# EasyEDA Pro project ProProject_基于CW32单片机的墙体探测仪_2024-01-01.epro

# Schematic 基于CW32单片机的墙体探测仪
Create Date: 2023-11-19; Page Name: 基于CW32单片机的墙体探测仪; Project Name: 基于CW32单片机的墙体探测仪; Schematic Name: 基于CW32单片机的墙体探测仪; Update Date: 2023-12-26; Company: 嘉立创EDA; Page Size: A2; Version: V1.0
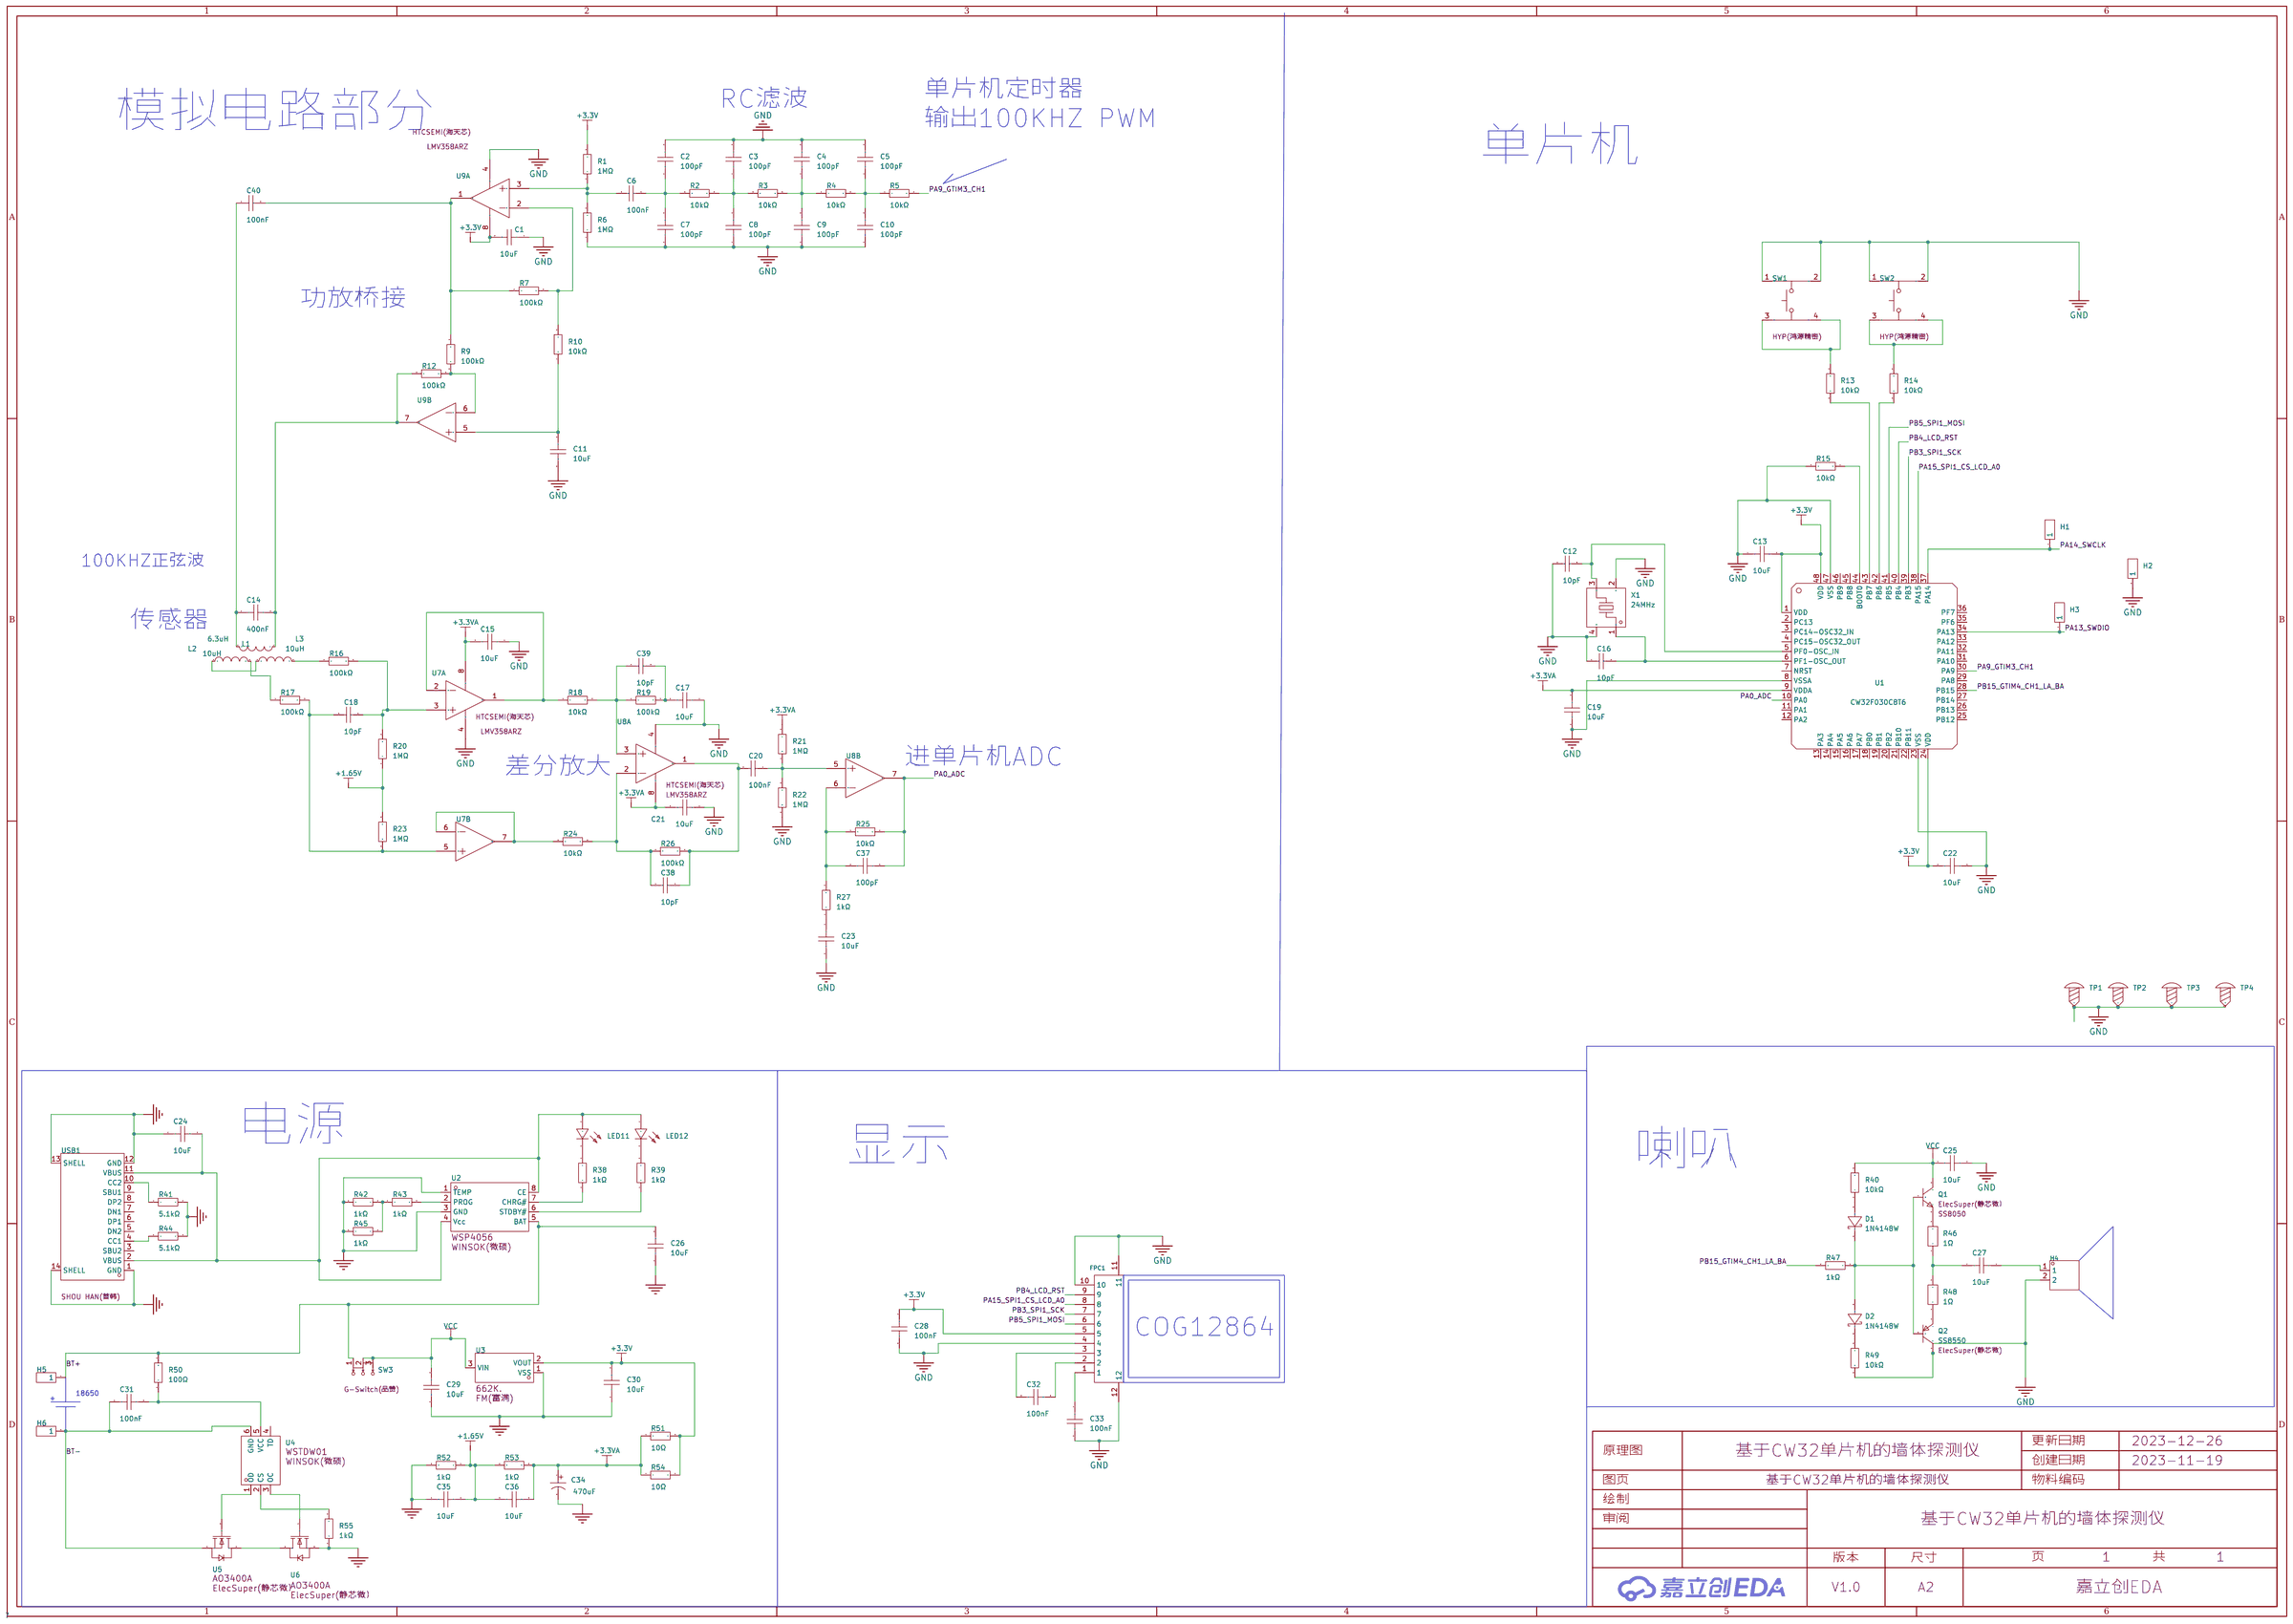
[diagram p0: schematic sheet]

## Parts
C1  10uF  [C0603]
C2  100pF  [C0603]
C3  100pF  [C0603]
C4  100pF  [C0603]
C5  100pF  [C0603]
C6  100nF  [C0603]
C7  100pF  [C0603]
C8  100pF  [C0603]
C9  100pF  [C0603]
C10  100pF  [C0603]
C11  10uF  [C0603]
C12  10pF  [C0603]
C13  10uF  [C0603]
C14  400nF  [CAP-TH_L10.5-W6.0-P7.50-D1.2]
C15  10uF  [C0603]
C16  10pF  [C0603]
C17  10uF  [C0603]
C18  10pF  [C0603]
C19  10uF  [C0603]
C20  100nF  [C0603]
C21  10uF  [C0603]
C22  10uF  [C0603]
C23  10uF  [C0603]
C24  10uF  [C0603]
C25  10uF  [C0603]
C26  10uF  [C0603]
C27  10uF  [C0603]
C28  100nF  [C0603]
C29  10uF  [C0603]
C30  10uF  [C0603]
C31  100nF  [C0603]
C32  100nF  [C0603]
C33  100nF  [C0603]
C34  470uF  [CAP-TH_BD8.0-P3.50-D0.6-FD]
C35  10uF  [C0603]
C36  10uF  [C0603]
C37  100pF  [C0603]
C38  10pF  [C0603]
C39  10pF  [C0603]
C40  100nF  [C0603]
D1  1N4148W  [SOD-123_L2.7-W1.6-LS3.7-FD]
D2  1N4148W  [SOD-123_L2.7-W1.6-LS3.7-FD]
FPC1  -  [FPC-SMD_10P-P1.0_FGS-XJ-H2.0]
H1  -  [HDR-TH_1P-V-M_XKB_X4611WV-01I-C28D40]
H2  -  [HDR-TH_1P-V-M_XKB_X4611WV-01I-C28D40]
H3  -  [HDR-TH_1P-V-M_XKB_X4611WV-01I-C28D40]
H4  -  [HDR-TH_2P-P2.54-V-M-1]
H5  -  [HDR-TH_1P-V-M_XKB_X4611WV-01I-C28D40]
H6  -  [HDR-TH_1P-V-M_XKB_X4611WV-01I-C28D40]
L1  6.3uH  [L1206]
L2  10uH  [L1206]
L3  10uH  [L1206]
LED11  204-10SURD/S530-A3-L  [LED-TH_BD3.0-P2.54-FD]
LED12  204-10SURD/S530-A3-L  [LED-TH_BD3.0-P2.54-FD]
Q1  -  [SOT-23-3_L2.9-W1.3-P1.90-LS2.4-BR]
Q2  SS8550  [SOT-23-3_L2.9-W1.3-P1.90-LS2.4-BR]
R1  1MΩ  [R0603]
R2  10kΩ  [R0603]
R3  10kΩ  [R0603]
R4  10kΩ  [R0603]
R5  10kΩ  [R0603]
R6  1MΩ  [R0603]
R7  100kΩ  [R0603]
R9  100kΩ  [R0603]
R10  10kΩ  [R0603]
R12  100kΩ  [R0603]
R13  10kΩ  [R0603]
R14  10kΩ  [R0603]
R15  10kΩ  [R0603]
R16  100kΩ  [R0603]
R17  100kΩ  [R0603]
R18  10kΩ  [R0603]
R19  100kΩ  [R0603]
R20  1MΩ  [R0603]
R21  1MΩ  [R0603]
R22  1MΩ  [R0603]
R23  1MΩ  [R0603]
R24  10kΩ  [R0603]
R25  10kΩ  [R0603]
R26  100kΩ  [R0603]
R27  1kΩ  [R0603]
R38  1kΩ  [R0603]
R39  1kΩ  [R0603]
R40  10kΩ  [R0603]
R41  5.1kΩ  [R0603]
R42  1kΩ  [R0603]
R43  1kΩ  [R0603]
R44  5.1kΩ  [R0603]
R45  1kΩ  [R0603]
R46  1Ω  [R0603]
R47  1kΩ  [R0603]
R48  1Ω  [R0603]
R49  10kΩ  [R0603]
R50  100Ω  [R0603]
R51  10Ω  [R0603]
R52  1kΩ  [R0603]
R53  1kΩ  [R0603]
R54  10Ω  [R0603]
R55  1kΩ  [R0603]
SW1  -  [SW-TH_4P-L6.0-W6.0-P3.90-LS6.5]
SW2  -  [SW-TH_4P-L6.0-W6.0-P3.90-LS6.5]
SW3  SS-12F20-G070  [SW-TH_G-SWITCH_SS-12F20-G070]
TP1  -  [M3螺丝]
TP2  -  [M3螺丝]
TP3  -  [M3螺丝]
TP4  -  [M3螺丝]
U1  CW32F030C8T6  [LQFP-48_L7.0-W7.0-P0.50-LS9.0-TL]
U2  WSP4056  [SOP-8_L5.1-W3.9-P1.27-LS6.0-BL]
U3  662K.  [SOT-23-3_L2.9-W1.3-P1.90-LS2.4-BR]
U4  WSTDW01  [SOT-23-6_L2.9-W1.6-P0.95-LS2.8-BR]
U5  AO3400A  [SOT-23-3_L3.0-W1.6-P1.90-LS2.8-BR]
U6  AO3400A  [SOT-23-3_L3.0-W1.6-P1.90-LS2.8-BR]
U7  -  [SOP-8_L4.9-W3.9-P1.27-LS6.0-BL]  (sections 1,2)
U8  -  [SOP-8_L4.9-W3.9-P1.27-LS6.0-BL]  (sections 1,2)
U9  -  [SOP-8_L4.9-W3.9-P1.27-LS6.0-BL]  (sections 1,2)
USB1  TYPE-C16PIN2MD(073)  [USB-C-SMD_TYPE-C-6PIN-2MD-073]
X1  24MHz  [CRYSTAL-SMD_4P-L3.2-W2.5-BL]

## Library data of the parts
C1 C11 C13 C15 C17 C19 C21-C27 C29 C30 C35 C36 = CL10A106KP8NNNC: 容值:10uF;精度:±10%;额定电压:10V;材质(温度系数):X5R;; LCSC Part Name: 10uF±10%10V; Supplier Part: C19702; Manufacturer: SAMSUNG(三星); Supplier Footprint: 0603; JLCPCB Part Class: BasicPart; Datasheet: https://atta.szlcsc.com/upload/public/pdf/source/20160103/1457707703378.pdf; Supplier: LCSC; Tolerance: ±10%; Voltage Rated: 10V; Temperature Coefficient: X5R
C2-C5 C7-C10 C37 = CC0603JRNPO9BN101: 容值:100pF;精度:±5%;额定电压:50V;材质(温度系数):NP0;; LCSC Part Name: 100pF ±5% 50V; Supplier Part: C14665; Manufacturer: YAGEO(国巨); Supplier Footprint: 0603; JLCPCB Part Class: Extended Part; Datasheet: https://atta.szlcsc.com/upload/public/pdf/source/20181008/C309499_21CC21451B82C39E3D92150FD6B30293.pdf; Supplier: LCSC; Tolerance: ±5%; Voltage Rated: 50V; Temperature Coefficient: NP0
C6 C20 C40 = 0603B104K500NT: 容值:100nF;精度:±10%;额定电压:50V;材质(温度系数):X7R;; LCSC Part Name: 100nF ±10% 50V; Supplier Part: C30926; Manufacturer: FH(风华); Supplier Footprint: 0603; JLCPCB Part Class: Extended Part; Datasheet: https://atta.szlcsc.com/upload/public/pdf/source/20200305/C486355_26A10D38EF8C2A5C37091D0039909270.pdf; Supplier: LCSC; Tolerance: ±10%; Voltage Rated: 50V; Temperature Coefficient: X7R
C12 C16 C18 C38 C39 = CC0603JRNPO9BN100: 容值:10pF;精度:±5%;额定电压:50V;材质(温度系数):NP0;; LCSC Part Name: 10pF±5%50V; Supplier Part: C106245; Manufacturer: YAGEO(国巨); Supplier Footprint: 0603; JLCPCB Part Class: ExtendedPart; Datasheet: https://atta.szlcsc.com/upload/public/pdf/source/20170505/1493957837406.pdf; Supplier: LCSC; Tolerance: ±5%; Voltage Rated: 50V; Temperature Coefficient: NP0
C14 = MPP404J2A0701: 容值:400nF;精度:±5%;额定电压:100V;; LCSC Part Name: 400nF ±5% 100V; Supplier Part: C484926; Manufacturer: KYET(科雅); Supplier Footprint: 插件,P=7.5mm; JLCPCB Part Class: Extended Part; Datasheet: https://atta.szlcsc.com/upload/public/pdf/source/20200115/C484926_47D01147E547E2FB931F965C1ADAEE71.pdf; Supplier: LCSC; Tolerance: ±5%; Voltage Rated: 100V; Operating Temperature: -40℃~+105℃
C28 C31-C33 = CC0603KRX7R9BB104: 容值:100nF;精度:±10%;额定电压:50V;材质(温度系数):X7R;; LCSC Part Name: 100nF±10%50V; Supplier Part: C14663; Manufacturer: YAGEO(国巨); Supplier Footprint: 0603; JLCPCB Part Class: BasicPart; Datasheet: https://atta.szlcsc.com/upload/public/pdf/source/20180910/C282072_33301C7F631E79921B82A8DAC6BCC5B3.pdf; Supplier: LCSC; Tolerance: ±10%; Voltage Rated: 50V; Temperature Coefficient: X7R
C34 = KM477M016F12RR0VH2FP0: 容值:470uF;精度:±20%;额定电压:16V;; LCSC Part Name: 470uF±20%16V; Supplier Part: C28067; Manufacturer: CX(承兴); Supplier Footprint: 插件,D8xL12mm; JLCPCB Part Class: ExtendedPart; Datasheet: https://atta.szlcsc.com/upload/public/pdf/source/20211027/06D6BA3719C264B639DC286D935D03EA.pdf; Supplier: LCSC; Tolerance: ±20%; Rated Voltage: 16V; φD: 8mm; L: 12mm; Lead Spacing: 3.5mm; Lifetime @ Temp: 2000hrs@105℃
D1 D2 = 1N4148W_C7420318: 二极管配置:独立式;正向压降(Vf):1.25V@150mA;直流反向耐压(Vr):100V;平均整流电流(Io):150mA;功率:400mW;反向恢复时间(trr):4ns;; LCSC Part Name: 电压:100V 电流:150mA; Supplier Part: C7420318; Manufacturer: 宏迦橙; Supplier Footprint: SOD-123; JLCPCB Part Class: Extended Part; Datasheet: https://atta.szlcsc.com/upload/public/pdf/source/20230828/E5C3F7A4272052930A7E03B75759BF50.pdf; Supplier: LCSC; Diode Configuration: 独立式; Forward Voltage (Vf@If): 1.25V@150mA; Reverse Voltage (Vr): 100V; Average Rectified Current (Io): 150mA; Power Dissipation: 400mW; Reverse Leakage Current: 1uA@75V; Reverse Recovery Time (trr): 4ns; Operating Temperature: -55℃~+150℃
FPC1 = AFA01-S10FCA-00: 间距:1mm;触点数量:10;锁定特性:翻盖式;安装类型:卧贴;触点类型:下接;; LCSC Part Name: FPC1.0MM10P翻盖式H2.0mm下接; Supplier Part: C262756; Manufacturer: JS(钜硕电子); Supplier Footprint: P=1mm; JLCPCB Part Class: ExtendedPart; Supplier: LCSC; Pitch: 1mm; Number of Contacts: 10; Locking Feature: 翻盖式; Mounting Type: 卧贴; Contact Type: 下接; Height Above Board: 2mm; FFC, FCB Thickness: 0.3mm~0.3mm
H1-H3 H5 H6 = HDR-M_2.54_1x1P: Supplier Part: C81276; Supplier Footprint: 插件; JLCPCB Part Class: ExtendedPart
H4 = HDR-M_2.54_1x2P: Supplier Part: C124375; Supplier Footprint: 插件
L1-L3 = L_1206
LED11 LED12 = 204-10SURD/S530-A3-L: 发光颜色:红灯;二极管配置:-;主波长:624nm;色温:-;功率:60mW;安装方式:-;; LCSC Part Name: 红灯; Supplier Part: C99771; Manufacturer: EVERLIGHT(亿光); Supplier Footprint: 插件,D=3mm; JLCPCB Part Class: ExtendedPart; Datasheet: https://atta.szlcsc.com/upload/public/pdf/source/20170504/1493866972127.pdf; Supplier: LCSC; Emitted Color: 红灯; Lens Color: 雾状红; Dominant Wavelength: 624nm; Peak Wavelength: 632nm; Forward Current: 20mA; Power Dissipation: 60mW; Viewing Angle: 40°; Operating Temperature: -40℃~+85℃; Lamp Holder Type: 3mm圆形灯头
Q1 = SS8050_C5249676: PolarityNPN耗散功率(W)0.3最大集电极电流(mA)1500集电极-基极电压（V）40饱和压降（V）0.5集电极/基极电流（mA）800/80最大工作频率(MHz)100; LCSC Part Name: SS8050; Supplier Part: C5249676; Manufacturer: ElecSuper(静芯微）; Manufacturer Part: SS8050; Supplier Footprint: SOT-23; JLCPCB Part Class: ExtendedPart; Datasheet: https://atta.szlcsc.com/upload/public/pdf/source/20221109/25143ABAE3EF3AA2633DA047E92DED74.pdf; Supplier: LCSC
Q2 = SS8550_C5249677: 晶体管类型:PNP;集电极电流(Ic):1.5A;集射极击穿电压(Vceo):25V;功率(Pd):300mW;直流电流增益(hFE@Ic,Vce):120;; LCSC Part Name: 耐压:25V 电流:1.5A PNP; Supplier Part: C5249677; Manufacturer: ElecSuper(静芯微); Supplier Footprint: SOT-23; JLCPCB Part Class: Extended Part; Datasheet: https://atta.szlcsc.com/upload/public/pdf/source/20221109/B5F89F270175419A606360AB14C12800.pdf; Supplier: LCSC; Transistor Type: PNP; Collector Current (Ic): 1.5A; Collector-Emitter Breakdown Voltage (Vceo): 25V; Power Dissipation (Pd): 300mW; DC Current Gain (hFE@Ic,Vce): 120; Transition Frequency (fT): 100MHz; Collector Cut-Off Current (Icbo): 100nA; Collector-Emitter Saturation Voltage (VCE(sat)@Ic,Ib): 500mV; Operating Temperature: 150℃
R1 R6 R20-R23 = 0603WAF1004T5E: 电阻类型:厚膜电阻;阻值:1MΩ;精度:±1%;功率:100mW;; LCSC Part Name: 1MΩ±1%100mW; Supplier Part: C22935; Manufacturer: UNI-ROYAL(厚声); Supplier Footprint: 0603; JLCPCB Part Class: BasicPart; Datasheet: https://atta.szlcsc.com/upload/public/pdf/source/20200306/C422600_1E6D84923E4A46A82E41ADD87F860B5C.pdf; Supplier: LCSC; Type: 厚膜电阻; Tolerance: ±1%; Power(Watts): 100mW; Temperature Coefficient: ±100ppm/℃; Overload Voltage (Max): 75V; Operating Temperature Range: -55℃~+155℃
R2-R5 R10 R13-R15 R18 R24 R25 R40 R41 R44 R49 = RC0603FR-0710KL: 电阻类型:厚膜电阻;阻值:10kΩ;精度:±1%;功率:100mW;; LCSC Part Name: 10kΩ±1%100mW; Supplier Part: C98220; Manufacturer: YAGEO(国巨); Supplier Footprint: 0603; JLCPCB Part Class: ExtendedPart; Datasheet: https://atta.szlcsc.com/upload/public/pdf/source/20170522/1495423494387.pdf; Supplier: LCSC; Type: 厚膜电阻; Tolerance: ±1%; Power(Watts): 100mW; Temperature Coefficient: ±100ppm/℃; Overload Voltage (Max): 75V; Operating Temperature Range: -55℃~+155℃
R7 R9 R12 R16 R17 R19 R26 = RC0603FR-07100KL: 电阻类型:厚膜电阻;阻值:100kΩ;精度:±1%;功率:100mW;; LCSC Part Name: 100kΩ±1%100mW; Supplier Part: C14675; Manufacturer: YAGEO(国巨); Supplier Footprint: 0603; JLCPCB Part Class: ExtendedPart; Datasheet: https://atta.szlcsc.com/upload/public/pdf/source/20140324/1457707028752.pdf; Supplier: LCSC; Type: 厚膜电阻; Tolerance: ±1%; Power(Watts): 100mW; Temperature Coefficient: ±100ppm/℃; Overload Voltage (Max): 75V; Operating Temperature Range: -55℃~+155℃
R27 R38 R39 R42 R43 R45 R47 R52 R53 R55 = RC0603FR-071KL: 电阻类型:厚膜电阻;阻值:1kΩ;精度:±1%;功率:100mW;; LCSC Part Name: 1kΩ±1%100mW; Supplier Part: C22548; Manufacturer: YAGEO(国巨); Supplier Footprint: 0603; JLCPCB Part Class: ExtendedPart; Datasheet: https://atta.szlcsc.com/upload/public/pdf/source/20180312/7BD3618A8B6324EA6280B0497A051AB7.pdf; Supplier: LCSC; Type: 厚膜电阻; Tolerance: ±1%; Power(Watts): 100mW; Temperature Coefficient: ±100ppm/℃; Overload Voltage (Max): 75V; Operating Temperature Range: -55℃~+155℃
R46 R48 = SCR0603F1R: 阻值:1Ω;精度:±1%;; LCSC Part Name: 1Ω ±1%; Supplier Part: C3016186; Manufacturer: VO(翔胜); Supplier Footprint: 0603; JLCPCB Part Class: Extended Part; Datasheet: https://atta.szlcsc.com/upload/public/pdf/source/20220513/247AF9639BA21CF93567DC289CCC6A22.pdf; Supplier: LCSC; Tolerance: ±1%
R50 = RC0603FR-07100RL: 电阻类型:厚膜电阻;阻值:100Ω;精度:±1%;功率:100mW;; LCSC Part Name: 100Ω±1%100mW; Supplier Part: C105588; Manufacturer: YAGEO(国巨); Supplier Footprint: 0603; JLCPCB Part Class: ExtendedPart; Datasheet: https://atta.szlcsc.com/upload/public/pdf/source/20170428/1493376742308.pdf; Supplier: LCSC; Type: 厚膜电阻; Tolerance: ±1%; Power(Watts): 100mW; Temperature Coefficient: ±100ppm/℃; Overload Voltage (Max): 75V; Operating Temperature Range: -55℃~+155℃
R51 R54 = 0603WAF100JT5E: 电阻类型:厚膜电阻;阻值:10Ω;精度:±1%;功率:100mW;; LCSC Part Name: 10Ω±1%100mW; Supplier Part: C22859; Manufacturer: UNI-ROYAL(厚声); Supplier Footprint: 0603; JLCPCB Part Class: BasicPart; Datasheet: https://atta.szlcsc.com/upload/public/pdf/source/20200306/C422600_1E6D84923E4A46A82E41ADD87F860B5C.pdf; Supplier: LCSC; Type: 厚膜电阻; Tolerance: ±1%; Power(Watts): 100mW; Temperature Coefficient: ±400ppm/℃; Overload Voltage (Max): 75V; Operating Temperature Range: -55℃~+155℃
SW1 SW2 = 1TS005A-2500-5001: 触点电流:50mA;额定电压(DC):12V;额定功率:0.6W;绝缘电阻:100MΩ;电路结构:单刀单掷;安装方式:直插;带灯:无;作用力:250gf@±50gf;机械寿命:7万次;带支架:否;; LCSC Part Name: 6*6*5mm直插轻触开关; Supplier Part: C255811; Manufacturer: HYP(鸿源精密); Supplier Footprint: 插件,6x6mm; JLCPCB Part Class: ExtendedPart; Datasheet: https://atta.szlcsc.com/upload/public/pdf/source/20180720/C255811_DA12C4E3C20854D48E888AEA64926F5F.pdf; Supplier: LCSC; Contact Current: 50mA; Voltage Rating (DC): 12V; Power Rating: 0.6W; Insulation Resistance: 100MΩ; Circuit: 单刀单掷; Mounting Style: 直插; Actuator Style: 圆形按钮; Actuator/Cap Color: 黑色; With Lamp: 无; Operating Force: 250gf@±50gf; Mechanical Life: 7万次; Operating Temperature: -40℃~+90℃; Pin Style: PC引脚; Switch Length: 6mm; Switch Width: 6mm; Switch Height: 5mm; Strike Gundam: 否
SW3 = SS-12F20-G070: 额定电流(DC):500mA;额定电压(DC):250V;电路结构:单刀双掷;安装方式:直插;机械寿命:-;开关颜色:黑色;; LCSC Part Name: 柄长7mm直插两档滑动开关; Supplier Part: C2848914; Manufacturer: G-Switch(品赞); Supplier Footprint: 插件; JLCPCB Part Class: ExtendedPart; Datasheet: https://atta.szlcsc.com/upload/public/pdf/source/20210825/E0137178672C137814869A76188F885C.pdf; Supplier: LCSC; Current Rating (DC): 500mA; Voltage Rating (DC): 250V; Circuit: 单刀双掷; Mounting Style: 直插; Actuator Color: 黑色; Actuator Style: 矩形柱状; Pin Style: PC引脚; Switch Length: 11.5mm; Switch Width: 5.8mm; Switch Height: 12mm
TP1-TP4 = M3螺丝: Supplier Footprint: 插件
U1 = CW32F030C8T6_C3019113: CPU内核:ARMCortex-M0+;CPU最大主频:64MHz;工作电压范围:1.65V~5.5V;内部振荡器:有;外部时钟频率范围:4MHz~32MHz;程序FLASH容量:-;RAM总容量:8KB;EEPROM/数据FLASH容量:-;GPIO端口数量:39;ADC(单元数/通道数/位数):1@x16ch/12bit;DAC(单元数/通道数/位数):-;(E)PWM(单元数/通道数/位数):-;8位Timer数量:-;16位Timer数量:8;32位Timer数量:-;内部比较器数量:2;U; LCSC Part Name: ARMCortex-M0+64MHzRAM：8KB; Supplier Part: C3019113; Manufacturer: CW(芯源); Supplier Footprint: LQFP-48; JLCPCB Part Class: ExtendedPart; Datasheet: https://atta.szlcsc.com/upload/public/pdf/source/20220516/D60F5E1023A73FFF550D4A77416DDFBC.pdf; Supplier: LCSC; CPU Core: ARMCortex-M0+; Maximum Frequency: 64MHz; Supply Voltage Range: 1.65V~5.5V; Internal Oscillator: 有; External Clock Frequency Rang: 4MHz~32MHz; RAM Size: 8KB; GPIO Ports Number: 39; ADC (Units/Channels/bits): 1@x16ch/12bit; 16Bit Timer Number: 8; CMP Number: 2; U(S)ART Number: 3; I2C Number: 2; (Q)SPI Number: 2; Peripherals / Functions / Protocol Stacks: 片载温度传感器；DMA；看门狗；低电压检测；CRC校验; Operating Temperature Range: -40℃~105℃
U2 = WSP4056: Supplier Part: C2985892; Manufacturer: WINSOK(微硕); Supplier Footprint: SOP-8; JLCPCB Part Class: ExtendedPart; Supplier: LCSC
U3 = 662K.: 输出类型:-;; LCSC Part Name: 662K; Supplier Part: C841298; Manufacturer: FM(富满); Supplier Footprint: SOT23-3; JLCPCB Part Class: ExtendedPart; Datasheet: https://atta.szlcsc.com/upload/public/pdf/watermark/20200922/C841298_3E220732626B158CD6AC195AF78C7FB8.pdf; Supplier: LCSC
U4 = WSTDW01: 充电电池的类型:-;电池单元组数:-;最大充电电流:-;充满的电池组电压:-;最大供应电压:-;; Supplier Part: C86873; Manufacturer: WINSOK(微硕); Supplier Footprint: SOT-23-6; JLCPCB Part Class: ExtendedPart; Datasheet: https://atta.szlcsc.com/upload/public/pdf/source/20161110/1478743415995.pdf; Supplier: LCSC
U5 U6 = AO3400A_C5224194: 类型:N沟道;漏源电压(Vdss):30V;连续漏极电流(Id):6A;功率(Pd):1.4W;导通电阻(RDS(on)@Vgs,Id):19mΩ@10V,6.0A;; LCSC Part Name: N沟道30V6A; Supplier Part: C5224194; Manufacturer: ElecSuper(静芯微）; Supplier Footprint: SOT-23-3L; JLCPCB Part Class: ExtendedPart; Datasheet: https://atta.szlcsc.com/upload/public/pdf/source/20221027/D95D9171DDBB7BB324532F3AF1EADB7E.pdf; Supplier: LCSC; Type: N沟道; Drain Source Voltage (Vdss): 30V; Continuous Drain Current (Id): 6A; Power Dissipation (Pd): 1.4W; Drain Source On Resistance (RDS(on)@Vgs,Id): 19mΩ@10V,6.0A; Gate Threshold Voltage (Vgs(th)@Id): 1V@250uA
U7-U9 = LMV358ARZ: CMOS低功耗双路运算放大器; Supplier Part: C2928823; Manufacturer: HTCSEMI(海天芯); Supplier Footprint: SOP-8; JLCPCB Part Class: ExtendedPart; Datasheet: https://atta.szlcsc.com/upload/public/pdf/source/20220114/2D4B849A76DE33264688A93B3A90A0F8.pdf; Supplier: LCSC
USB1 = TYPE-C 16PIN 2MD(073): 连接器类型:Type-C;标准:-;公母:母座;触点数量:16;端口数量:1;安装方式:卧贴;额定电流-电源:5A;工作温度范围:-25℃~+85℃;; LCSC Part Name: TYPE-C母座16P4脚插件带定位柱不锈钢外壳2次模顶; Supplier Part: C2765186; Manufacturer: SHOU HAN(首韩); Supplier Footprint: SMD; JLCPCB Part Class: ExtendedPart; Datasheet: https://atta.szlcsc.com/upload/public/pdf/source/20211123/39B17C16241EAC15C5E277BDA434118E.pdf; Supplier: LCSC; Connector Type: Type-C; Gender: 母座; Number of Contacts: 16; Number of Ports: 1; Mounting Style: 卧贴; Current Rating - Power (Max): 5A; Operating Temperature Range: -25℃~+85℃
X1 = 3TJ424000HYFBC: 频率:24MHz;频率公差:±10ppm;负载电容:9pF;; LCSC Part Name: 24MHz ±10ppm 9pF; Supplier Part: C2149055; Manufacturer: JYJE(晶友嘉); Supplier Footprint: SMD3225-4P; JLCPCB Part Class: Extended Part; Datasheet: https://atta.szlcsc.com/upload/public/pdf/source/20210114/C2149013_C841380407E0329693B4ECED06382C6A.pdf; Supplier: LCSC; Crystal Type: 贴片无源晶振; Frequency Tolerance: ±10ppm; Frequency Stability: ±30ppm; Load Capacitance: 9pF; Equivalent Series Resistance (ESR): 60Ω; Operating Temperature: -40℃~+85℃

## Nets
+1.65V: C35.2 C36.1 R20.1 R23.2 R52.1 R53.2
+3.3V: C1.2 C13.2 C22.1 C28.1 C30.2 FPC1.5 R1.2 R51.2 R54.2 U1.1(VDD) U1.24(VDD) U1.48(VDD) U3.2(VOUT) U9.8(VCC)
+3.3VA: C15.2 C19.2 C21.2 C34.1 C36.2 R21.2 R51.1 R53.1 R54.1 U1.9(VDDA) U7.8(VCC) U8.8(VCC)
GND: C1.1 C2.2 C3.2 C4.2 C5.2 C7.1 C8.1 C9.1 C10.1 C11.2 C12.1 C13.1 C15.1 C16.1 C17.1 C19.1 C21.1 C22.2 C23.2 C24.1 C25.2 C26.1 C28.2 C29.1 C30.1 C33.2 C34.2 C35.1 FPC1.4 FPC1.10 FPC1.11 FPC1.12 H2.1 H4.2 Q2.3(C) R6.1 R15.2 R22.1 R41.2 R42.2 R44.2 R45.2 R49.1 R52.2 R55.1 SW1.1 SW1.2 SW2.1 SW2.2 TP1.1 TP2.1 TP3.1 TP4.1 U1.8(VSSA) U1.23(VSS) U1.47(VSS) U2.1(TEMP) U2.3(GND) U3.1(VSS) U6.2(S) U7.4(GND) U8.4(GND) U9.4(GND) USB1.1(GND) USB1.12(GND) USB1.13(SHELL) USB1.14(SHELL) X1.2(GND) X1.4(GND)
VCC: C25.1 C29.2 Q1.3(C) R40.2 SW3.2 SW3.3 U3.3(VIN)
BT+: C26.2 H5.1 R50.2 SW3.1 U2.5(BAT)
BT-: C31.1 H6.1 U4.6(GND) U5.2(S)
PA0_ADC: C37.1 R25.2 U1.10(PA0) U8.7(OUT2)
PA9_GTIM3_CH1: R5.2 U1.30(PA9)
PA13_SWDIO: H3.1 U1.34(PA13)
PA14_SWCLK: H1.1 U1.37(PA14)
PA15_SPI1_CS_LCD_A0: FPC1.8 U1.38(PA15)
PB3_SPI1_SCK: FPC1.7 U1.39(PB3)
PB4_LCD_RST: FPC1.9 U1.40(PB4)
PB5_SPI1_MOSI: FPC1.6 U1.41(PB5)
PB15_GTIM4_CH1_LA_BA: R47.2 U1.28(PB15)
$1N13991: U5.3(D) U6.3(D)
$1N14154: U4.1(OD) U5.1(G)
$1N14198: U4.3(OC) U6.1(G)
$1N14351: R55.2 U4.2(CS)
$1N15015: R43.1 U2.2(PROG)
$1N15845: R38.1 U2.7(CHRG#)
$1N15894: R39.1 U2.6(STDBY#)
$1N16826: R44.1 USB1.4(CC1)
$1N16875: R41.1 USB1.10(CC2)
$1N19532: C31.2 R50.1 U4.5(VCC)
$1N165486: R42.1 R43.2 R45.1
$1N167672: C24.2 LED11.1(A) LED12.1(A) U2.4(Vcc) U2.8(CE) USB1.2(VBUS) USB1.11(VBUS)
$1N179497: LED11.2(K) R38.2
$1N179538: LED12.2(K) R39.2
$1N206778: R15.1 U1.44(BOOT0)
$1N234129: R13.1 SW1.3 SW1.4
$1N234138: R14.1 SW2.3 SW2.4
$1N234147: R13.2 U1.43(PB7)
$1N234151: R14.2 U1.42(PB6)
$1N252869: C33.1 FPC1.1
$1N252872: C32.2 FPC1.2
$1N252875: C32.1 FPC1.3
$1N256375: C3.1 C8.2 R2.2 R3.1
$1N256389: C4.1 C9.2 R3.2 R4.1
$1N256398: C5.1 C10.2 R4.2 R5.1
$1N256743: C2.1 C6.2 C7.2 R2.1
$1N259805: R24.1 U7.6(IN2-) U7.7(OUT2)
$1N259808: R18.1 U7.1(OUT) U7.2(IN1-)
$1N260186: C20.1 R21.1 R22.2 U8.5(IN2+)
$1N260302: C23.1 R27.1
$1N263980: C6.1 R1.1 R6.2 U9.3(IN1+)
$1N267629: D1.1(A) R40.1
$1N267665: D2.2(K) R49.2
$1N267709: C27.2 H4.1
$1N274948: C16.2 U1.6(PF1-OSC_OUT) X1.1
$1N275074: C12.2 U1.5(PF0-OSC_IN) X1.3
$1N281778: C18.1 R17.2 R23.1 U7.5(IN2+)
$1N281786: C18.2 R16.2 R20.2 U7.3(IN1+)
$1N284976: Q1.2(E) R46.2
$1N284978: Q2.2(E) R48.1
$1N291348: R9.2 R12.1 U9.6(IN2-)
$1N299296: C37.2 R25.1 R27.2 U8.6(IN2-)
$1N299403: C39.1 R18.2 R19.1 U8.3(IN1+)
$1N299407: C17.2 C39.2 R19.2
$1N299413: C38.1 R24.2 R26.1 U8.2(IN1-)
$1N299416: C20.2 C38.2 R26.2 U8.1(OUT)
$1N299581: C27.1 R46.1 R48.2
$1N299584: D1.2(K) D2.1(A) Q1.1(B) Q2.1(B) R47.1
$1N303075: C40.2 R7.1 R9.1 U9.1(OUT)
Net-(C11-1): C11.1 R10.1 U9.5(IN2+)
Net-(C14-1): C14.1 C40.1 L1.2
Net-(C14-2): C14.2 L1.1 R12.2 U9.7(OUT2)
Net-(L2-1): L2.1 L3.1
Net-(L2-2): L2.2 R17.1
Net-(L3-2): L3.2 R16.1
Net-(R7-2): R7.2 R10.2 U9.2(IN1-)

Not connected (* = marked no-connect by the designer): U1 2(PC13) 3(PC14-OSC32_IN) 4(PC15-OSC32_OUT) 7(NRST) 11(PA1) 12(PA2) 13(PA3) 14(PA4) 15(PA5) 16(PA6) 17(PA7) 18(PB0) 19(PB1) 20(PB2) 21(PB10) 22(PB11) 25(PB12) 26(PB13) 27(PB14) 29(PA8) 31(PA10) 32(PA11) 33(PA12) 35(PF6) 36(PF7) 45(PB8) 46(PB9); U4 4(TD); USB1 3(SBU2) 5(DN2) 6(DP1) 7(DN1) 8(DP2) 9(SBU1)

## Notes on the sheet
- RC滤波
- 模拟电路部分
- 单片机定时器
  输出100KHZ PWM
- 单片机
- 功放桥接
- 100KHZ正弦波
- 传感器
- 进单片机ADC
- 差分放大
- 电源
- 显示
- 喇叭
- COG12864
- +
- 18650

# Board PCB4
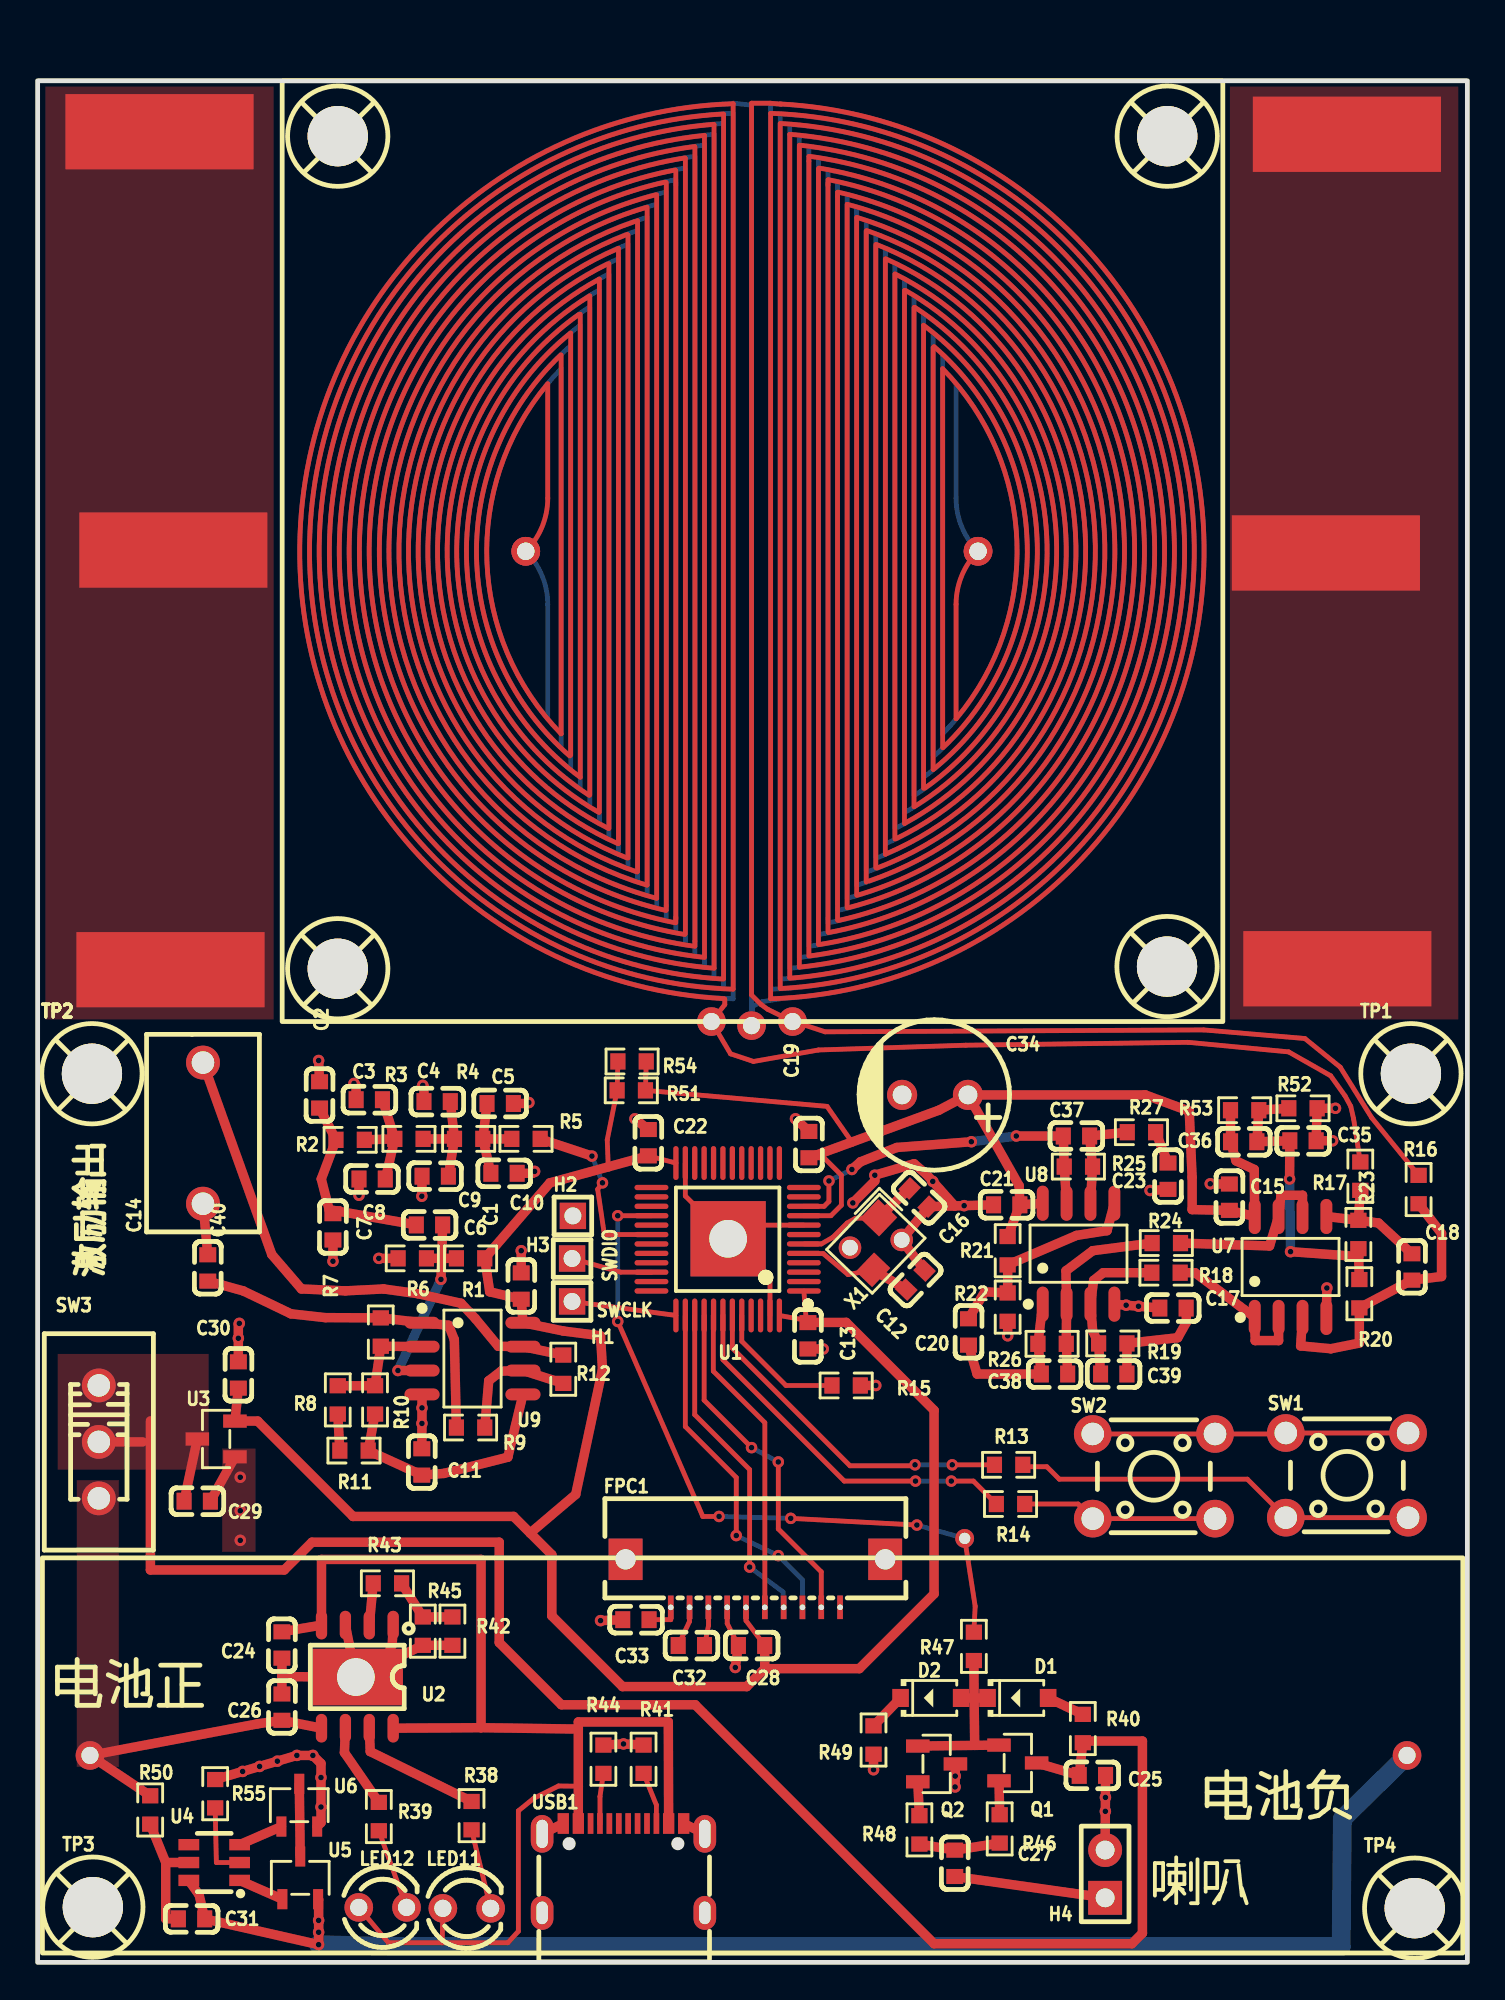
[diagram p1: board, top side]
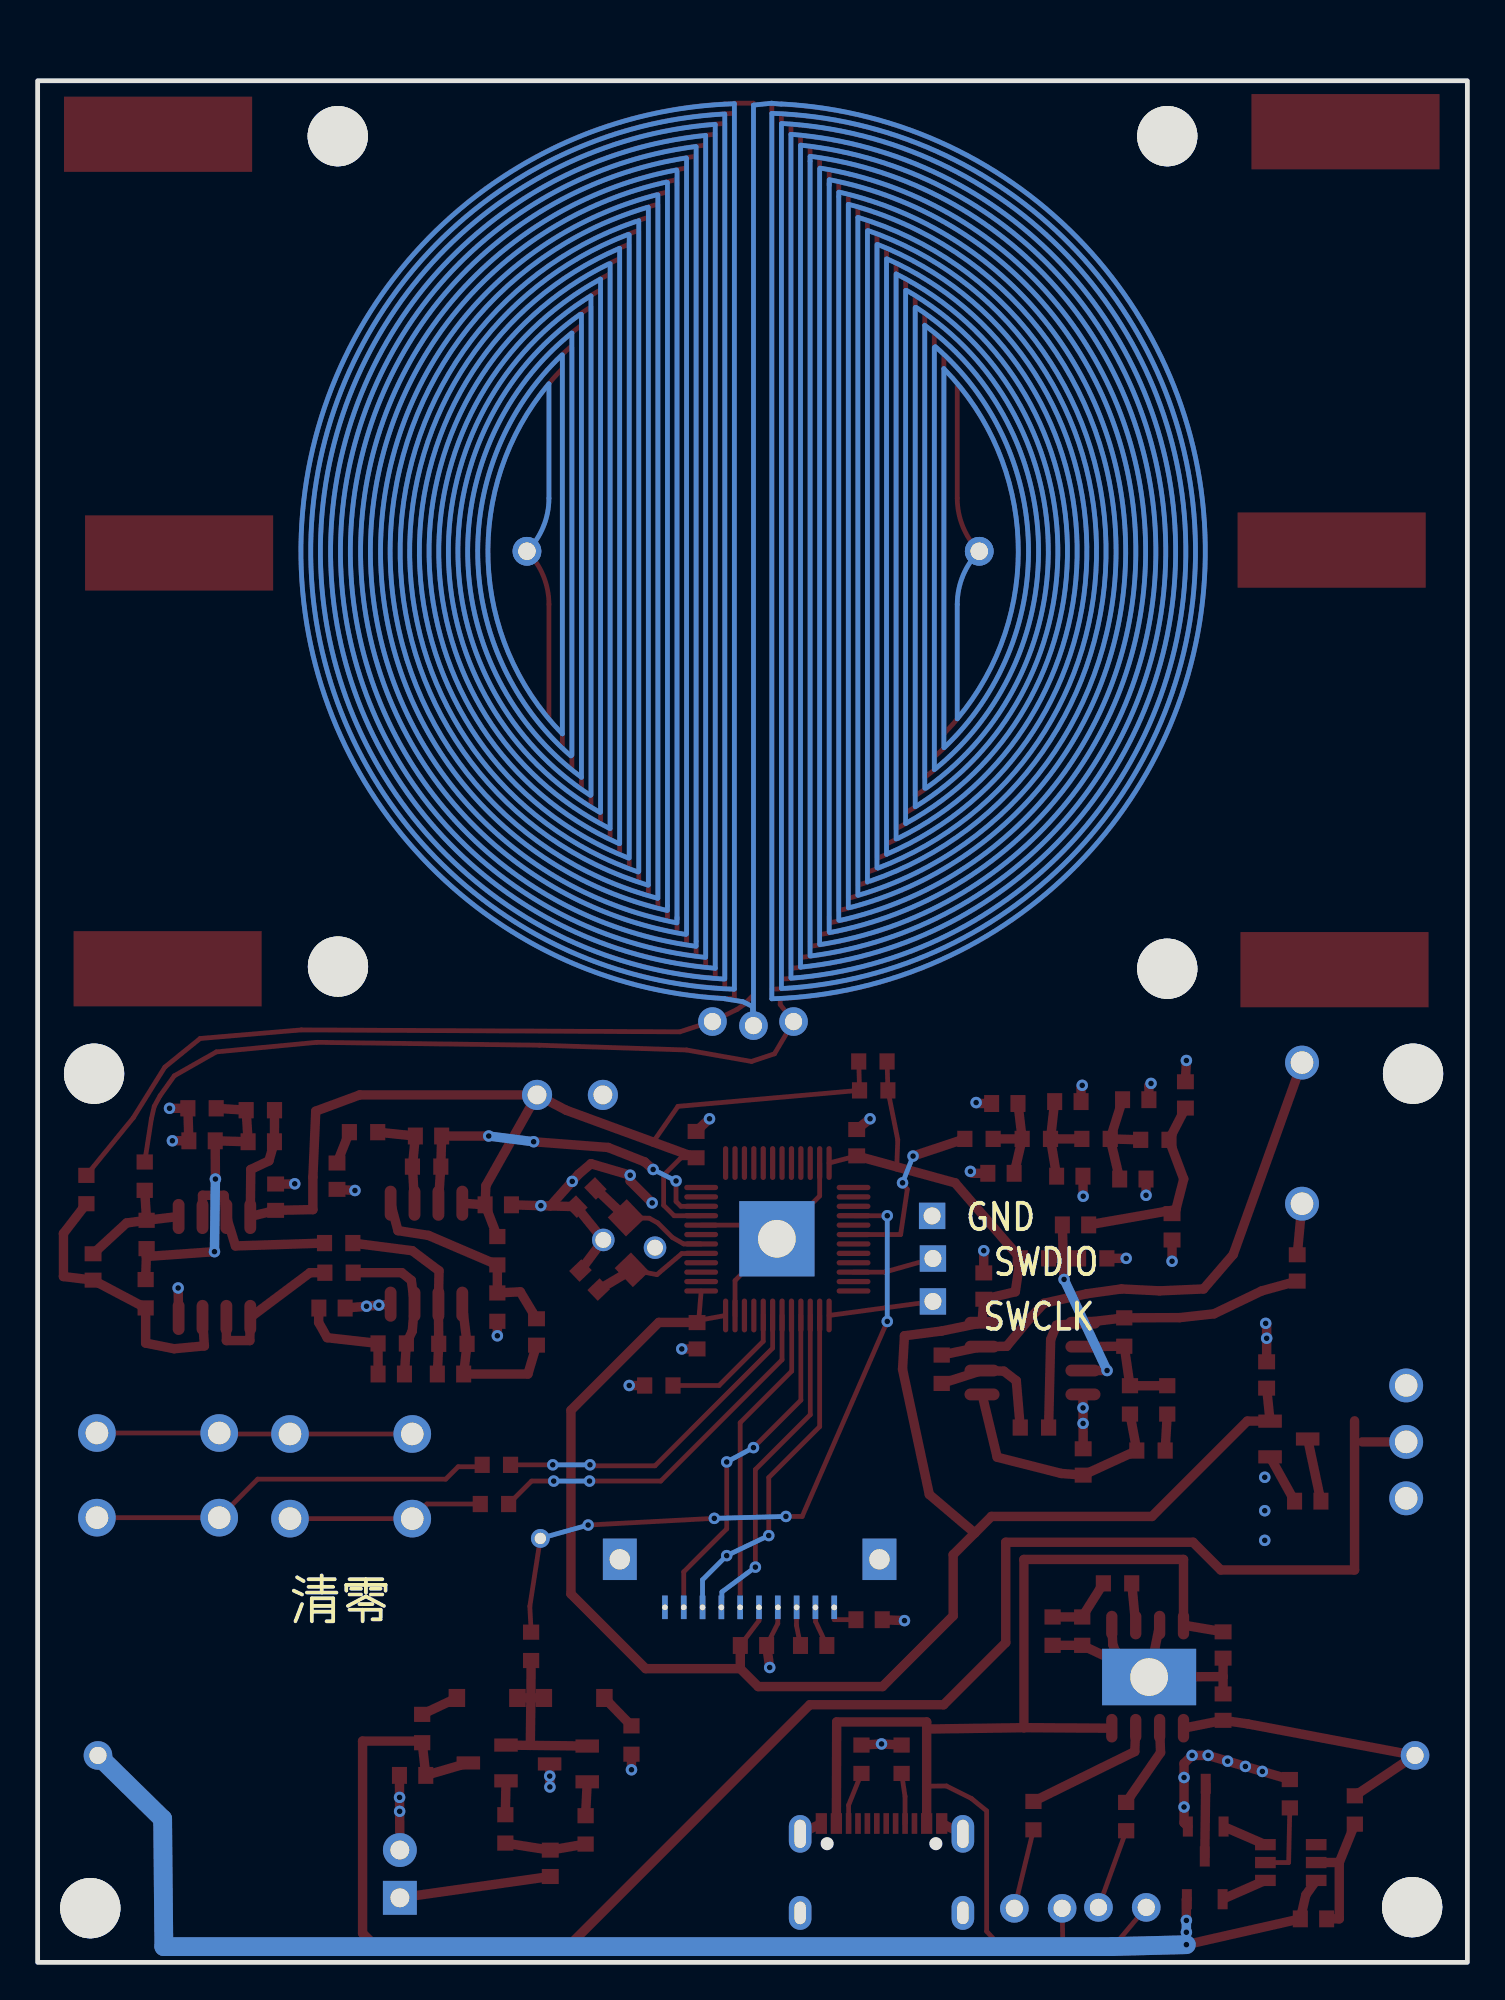
[diagram p2: board, bottom side, seen from below]

Outline 76 x 100 mm; copper layers: Top Layer, Bottom Layer. Coordinates in mm from the lower left corner of the outline.
Outline path: rectangle 0,100 76,0
Stack: Top Layer 0.035mm / Dielectric1 1.51mm FR4 er 4.5 / Bottom Layer 0.035mm

## Design rules (mm)
template: 自定义配置
spacing copperThickness1oz (default): track to track 0.102, other pairs 0.152 to 0.3
spacing copperThickness2oz: track to track 0.203, other pairs 0.152 to 0.3
track width copperThickness1oz (default): min 0.127, default 0.254, max 2.54
track width copperThickness2oz: min 0.203, default 0.254, max 2.54
differential pair differentialPair (default): width min 0.127, default 0.254, max 2.54; gap min 0.152, default 0.152
via viaSize (default): diameter min 0.5, default 0.61, max 10; hole min 0.3, default 0.305, max 6.3

## Placement (name value [footprint] x y rotation side)
C1  10uF  [C0603]  25.71 35.94 270 top
C2  100pF  [C0603]  14.99 46.1 90 top
C3  100pF  [C0603]  17.63 45.85 180 top
C4  100pF  [C0603]  21.24 45.75 180 top
C5  100pF  [C0603]  24.59 45.64 0 top
C6  100nF  [C0603]  20.83 39.19 180 top
C7  100pF  [C0603]  15.7 39.09 90 top
C8  100pF  [C0603]  17.78 41.63 0 top
C9  100pF  [C0603]  21.13 41.78 0 top
C10  100pF  [C0603]  24.79 41.94 180 top
C11  10uF  [C0603]  20.42 26.59 90 top
C12  10pF  [C0603]  46.66 36.26 226.2 top
C13  10uF  [C0603]  40.95 33.3 90 top
C14  400nF  [CAP-TH_L10.5-W6.0-P7.50-D1.2]  8.79 44.07 90 top
C15  10uF  [C0603]  63.35 40.67 270 top
C16  10pF  [C0603]  46.85 40.65 136.2 top
C17  10uF  [C0603]  60.35 34.77 0 top
C18  10pF  [C0603]  73.05 36.96 270 top
C19  10uF  [C0603]  41 43.46 270 top
C20  100nF  [C0603]  49.48 33.5 270 top
C21  10uF  [C0603]  51.51 40.26 0 top
C22  10uF  [C0603]  32.46 43.56 90 top
C23  10uF  [C0603]  60.09 41.78 270 top
C24  10uF  [C0603]  12.98 16.87 90 top
C25  10uF  [C0603]  56.07 9.94 0 top
C26  10uF  [C0603]  12.98 13.56 270 top
C27  10uF  [C0603]  48.75 5.26 270 top
C28  100nF  [C0603]  37.95 16.84 180 top
C29  10uF  [C0603]  8.48 24.51 180 top
C30  10uF  [C0603]  10.67 31.22 270 top
C31  100nF  [C0603]  8.18 2.31 180 top
C32  100nF  [C0603]  34.75 16.84 180 top
C33  100nF  [C0603]  31.8 18.21 180 top
C34  470uF  [CAP-TH_BD8.0-P3.50-D0.6-FD]  47.7 46.1 180 top
C35  10uF  [C0603]  67.26 43.66 180 top
C36  10uF  [C0603]  64.11 43.61 180 top
C37  100pF  [C0603]  55.22 43.92 0 top
C38  10pF  [C0603]  54.05 31.27 180 top
C39  10pF  [C0603]  57.2 31.27 0 top
C40  100nF  [C0603]  9.04 36.91 270 top
D1  1N4148W  [SOD-123_L2.7-W1.6-LS3.7-FD]  52.1 14.05 180 top
D2  1N4148W  [SOD-123_L2.7-W1.6-LS3.7-FD]  47.48 14.05 180 top
FPC1  -  [fpc-smd_10p-p1.0_fgs-xj-h2.0]  38.15 20.14 0 top
H1  -  [HDR-TH_1P-V-M_XKB_X4611WV-01I-C28D40]  28.41 35.13 0 top
H2  -  [HDR-TH_1P-V-M_XKB_X4611WV-01I-C28D40]  28.45 39.67 0 top
H3  -  [HDR-TH_1P-V-M_XKB_X4611WV-01I-C28D40]  28.41 37.41 0 top
H4  -  [HDR-TH_2P-P2.54-V-M-1]  56.75 4.7 90 top
LED11  204-10SURD/S530-A3-L  [LED-TH_BD3.0-P2.54-FD]  22.81 2.87 0 top
LED12  204-10SURD/S530-A3-L  [LED-TH_BD3.0-P2.54-FD]  18.34 2.92 0 top
NOREF  -  [Pad_e886]  40.13 50 180 top
NOREF#2  -  [Pad_e147]  69.6 97.16 0 top
NOREF#3  -  [Pad_e139]  7.22 75.06 0 top
NOREF#4  -  [Pad_e141]  68.48 74.91 0 top
NOREF#5  -  [Pad_e1206]  49.28 22.53 0 top
NOREF#6  -  [Pad_e1243]  36.7 38.46 0 top
NOREF#7  -  [Pad_e795]  25.95 74.99 0 top
NOREF#8  -  [Pad_e142]  6.48 97.29 0 top
NOREF#9  -  [Pad_e143]  69.09 52.81 0 top
NOREF#10  -  [Pad_e677]  49.99 74.99 180 top
NOREF#11  -  [Pad_e887]  35.82 50 180 top
NOREF#12  -  [Pad_e30]  72.79 11 0 top
NOREF#13  -  [Pad_e170]  16.92 15.16 0 top
NOREF#14  -  [Pad_e29]  2.78 11 0 top
NOREF#15  -  [Pad_e146]  7.06 52.76 0 top
NOREF#16  -  [Pad_e885]  37.95 49.78 180 top
NOREF#17  -  [Pad_e730]  49.99 74.99 0 top
NOREF#18  -  [Pad_e848]  25.95 74.99 180 top
Q1  -  [SOT-23-3_L2.9-W1.3-P1.90-LS2.4-BR]  52.1 10.6 180 top
Q2  SS8550  [SOT-23-3_L2.9-W1.3-P1.90-LS2.4-BR]  47.79 10.55 180 top
R1  1MΩ  [R0603]  23.01 37.41 0 top
R2  10kΩ  [R0603]  16.61 43.71 0 top
R3  10kΩ  [R0603]  19.74 43.76 0 top
R4  10kΩ  [R0603]  22.91 43.76 0 top
R5  10kΩ  [R0603]  25.96 43.76 0 top
R6  1MΩ  [R0603]  19.91 37.41 0 top
R7  100kΩ  [R0603]  18.24 33.5 270 top
R8  10kΩ  [R0603]  15.95 29.89 90 top
R9  100kΩ  [R0603]  23.01 28.42 0 top
R10  10kΩ  [R0603]  17.94 29.89 90 top
R11  10kΩ  [R0603]  16.82 27.2 180 top
R12  100kΩ  [R0603]  27.94 31.52 90 top
R13  10kΩ  [R0603]  51.61 26.44 180 top
R14  10kΩ  [R0603]  51.72 24.36 180 top
R15  10kΩ  [R0603]  42.98 30.66 0 top
R16  100kΩ  [R0603]  73.41 41.07 270 top
R17  100kΩ  [R0603]  70.31 41.78 270 top
R18  10kΩ  [R0603]  59.98 36.65 180 top
R19  100kΩ  [R0603]  57.15 32.89 0 top
R20  1MΩ  [R0603]  70.26 35.54 270 top
R21  1MΩ  [R0603]  51.56 37.82 90 top
R22  1MΩ  [R0603]  51.56 34.82 90 top
R23  1MΩ  [R0603]  70.21 38.68 270 top
R24  10kΩ  [R0603]  60 38.23 180 top
R25  10kΩ  [R0603]  55.32 42.29 180 top
R26  100kΩ  [R0603]  53.93 32.87 180 top
R27  1kΩ  [R0603]  58.68 44.12 180 top
R38  1kΩ  [R0603]  23.06 7.8 270 top
R39  1kΩ  [R0603]  18.14 7.75 270 top
R40  10kΩ  [R0603]  55.56 12.43 270 top
R41  5.1kΩ  [R0603]  32.21 10.8 90 top
R42  1kΩ  [R0603]  22.05 17.6 270 top
R43  1kΩ  [R0603]  18.59 20.14 0 top
R44  5.1kΩ  [R0603]  30.07 10.8 90 top
R45  1kΩ  [R0603]  20.47 17.6 270 top
R46  1Ω  [R0603]  51.14 7.09 90 top
R47  1kΩ  [R0603]  49.77 16.79 90 top
R48  1Ω  [R0603]  46.87 7.04 270 top
R49  10kΩ  [R0603]  44.43 11.82 90 top
R50  100Ω  [R0603]  5.98 8.1 90 top
R51  10Ω  [R0603]  31.56 46.34 180 top
R52  1kΩ  [R0603]  67.26 45.39 0 top
R53  1kΩ  [R0603]  64.16 45.29 0 top
R54  10Ω  [R0603]  31.6 47.88 180 top
R55  1kΩ  [R0603]  9.44 8.96 270 top
SW1  -  [SW-TH_4P-L6.0-W6.0-P3.90-LS6.5]  69.6 25.88 0 top
SW2  -  [SW-TH_4P-L6.0-W6.0-P3.90-LS6.5]  59.34 25.83 0 top
SW3  SS-12F20-G070  [SW-TH_G-SWITCH_SS-12F20-G070]  3.25 27.66 90 top
TP1  -  [M3螺丝]  73.06 47.16 0 top
TP2  -  [M3螺丝]  2.95 47.16 0 top
TP2#2  -  [M3螺丝]  16.02 96.99 0 top
TP2#3  -  [M3螺丝]  60.11 96.99 0 top
TP2#4  -  [M3螺丝]  16.02 52.74 0 top
TP2#5  -  [M3螺丝]  60.1 52.86 0 top
TP3  -  [M3螺丝]  3 2.87 0 top
TP4  -  [M3螺丝]  73.26 2.82 0 top
U1  CW32F030C8T6  [LQFP-48_L7.0-W7.0-P0.50-LS9.0-TL]  36.68 38.43 180 top
U2  WSP4056  [SOP-8_L5.1-W3.9-P1.27-LS6.0-BL]  16.99 15.18 180 top
U3  662K.  [SOT-23-3_L2.9-W1.3-P1.90-LS2.4-BR]  9.49 27.81 0 top
U4  WSTDW01  [SOT-23-6_L2.9-W1.6-P0.95-LS2.8-BR]  9.39 5.31 0 top
U5  AO3400A  [SOT-23-3_L3.0-W1.6-P1.90-LS2.8-BR]  13.96 4.49 270 top
U6  AO3400A  [SOT-23-3_L3.0-W1.6-P1.90-LS2.8-BR]  13.91 8.35 270 top
U7  -  [SOP-8_L4.9-W3.9-P1.27-LS6.0-BL]  66.6 36.96 0 top
U8  -  [SOP-8_L4.9-W3.9-P1.27-LS6.0-BL]  55.33 37.66 0 top
U9  -  [SOP-8_L4.9-W3.9-P1.27-LS6.0-BL]  23.12 32.09 270 top
USB1  TYPE-C16PIN2MD(073)  [USB-C-SMD_TYPE-C-6PIN-2MD-073]  31.14 5 0 top
X1  24MHz  [crystal-smd_4p-l3.2-w2.5-bl]  44.56 38.19 226.2 top

## Footprints (pads in the part's own frame, mm; a bottom-side part is the same pattern mirrored in y, then rotated)
C0603
  rect 0.8x0.9 smd: 1(-0.7,0) 2(0.7,0)
CAP-TH_BD8.0-P3.50-D0.6-FD
  round 1.6 hole 1: 1(-1.75,0) 2(1.75,0)
CAP-TH_L10.5-W6.0-P7.50-D1.2
  round 1.8 hole 1.2: 1(-3.75,0) 2(3.75,0)
crystal-smd_4p-l3.2-w2.5-bl
  rect 1.4x1.4 smd: 1(-1.1,-0.85)
  round 1.2 hole 0.84: 2(1.1,-0.85) 4(-1.1,0.85)
  rect 1.4x1.2 smd: 3(1.1,0.85)
fpc-smd_10p-p1.0_fgs-xj-h2.0
  rect 0.3x1.25 hole 0.305: 1(-4.497,-1.276) 2(-3.498,-1.276) 3(-2.498,-1.276) 4(-1.497,-1.276) 5(-0.497,-1.276) 6(0.502,-1.276) 7(1.502,-1.276) 8(2.503,-1.276) 9(3.502,-1.274) 10(4.503,-1.274)
  rect 1.8x2.2 hole 1.08: 11(-6.9,1.276) 12(6.9,1.276)
HDR-TH_1P-V-M_XKB_X4611WV-01I-C28D40
  rect 1.4x1.4 hole 0.9: 1(0,0)
HDR-TH_2P-P2.54-V-M-1
  rect 1.8x1.8 hole 1: 1(-1.27,0)
  round 1.8 hole 1: 2(1.27,0)
LED-TH_BD3.0-P2.54-FD
  round 1.524 hole 0.914: 1(-1.27,0) 2(1.27,0)
LQFP-48_L7.0-W7.0-P0.50-LS9.0-TL
  oval 1.8x0.28 smd: 1(-4.05,2.75) 2(-4.05,2.25) 3(-4.05,1.75) 4(-4.05,1.25) 5(-4.05,0.75) 6(-4.05,0.25) 7(-4.05,-0.25) 8(-4.05,-0.75) 9(-4.05,-1.25) 10(-4.05,-1.75) 11(-4.05,-2.25) 12(-4.05,-2.75) 25(4.05,-2.75) 26(4.05,-2.25) 27(4.05,-1.75) 28(4.05,-1.25) 29(4.05,-0.75) 30(4.05,-0.25) 31(4.05,0.25) 32(4.05,0.75) 33(4.05,1.25) 34(4.05,1.75) 35(4.05,2.25) 36(4.05,2.75)
  oval 0.28x1.8 smd: 13(-2.75,-4.05) 14(-2.25,-4.05) 15(-1.75,-4.05) 16(-1.25,-4.05) 17(-0.75,-4.05) 18(-0.25,-4.05) 19(0.25,-4.05) 20(0.75,-4.05) 21(1.25,-4.05) 22(1.75,-4.05) 23(2.25,-4.05) 24(2.75,-4.05) 37(2.75,4.05) 38(2.25,4.05) 39(1.75,4.05) 40(1.25,4.05) 41(0.75,4.05) 42(0.25,4.05) 43(-0.25,4.05) 44(-0.75,4.05) 45(-1.25,4.05) 46(-1.75,4.05) 47(-2.25,4.05) 48(-2.75,4.05)
M3螺丝
  round 3.2 hole 3.2: 1(-0.064,0.064)
Pad_e29
  round 1.524 hole 0.914: 1(0,0)
Pad_e30
  round 1.524 hole 0.914: 2(0,0)
Pad_e139
  rect 10x4 smd: 1(0,0)
Pad_e141
  rect 10x4 smd: 1(0,0)
Pad_e142
  rect 10x4 smd: 1(0,0)
Pad_e143
  rect 10x4 smd: 1(0,0)
Pad_e146
  rect 10x4 smd: 1(0,0)
Pad_e147
  rect 10x4 smd: 1(0,0)
Pad_e170
  rect 5x3 hole 2: 1(0,0)
Pad_e677
  round 1.524 hole 0.914: 1(0,0)
Pad_e730
  round 1.524 hole 0.914: 1(0,0)
Pad_e795
  round 1.524 hole 0.914: 1(0,0)
Pad_e848
  round 1.524 hole 0.914: 1(0,0)
Pad_e885
  round 1.524 hole 0.914: 1(0,0)
Pad_e886
  round 1.524 hole 0.914: 2(0,0)
Pad_e887
  round 1.524 hole 0.914: 3(0,0)
Pad_e1206
  round 1 hole 0.6: 1(0,0)
Pad_e1243
  rect 4x4 hole 2: 1(0,0)
R0603
  rect 0.806x0.864 smd: 1(-0.753,0) 2(0.753,0)
SOD-123_L2.7-W1.6-LS3.7-FD
  rect 0.88x0.96 smd: 1(-1.61,0) 2(1.61,0)
SOP-8_L4.9-W3.9-P1.27-LS6.0-BL
  oval 0.63x1.865 smd: 1(-1.905,-2.683) 2(-0.635,-2.683) 3(0.635,-2.683) 4(1.905,-2.683) 5(1.905,2.683) 6(0.635,2.683) 7(-0.635,2.683) 8(-1.905,2.683)
SOP-8_L5.1-W3.9-P1.27-LS6.0-BL
  oval 0.6x1.52 smd: 1(-1.905,-2.74) 2(-0.635,-2.74) 3(0.635,-2.74) 4(1.905,-2.74) 5(1.905,2.74) 6(0.635,2.74) 7(-0.635,2.74) 8(-1.905,2.74)
SOT-23-3_L2.9-W1.3-P1.90-LS2.4-BR
  rect 1.25x0.7 smd: 1(1,-0.95) 2(1,0.95) 3(-1,0)
SOT-23-3_L3.0-W1.6-P1.90-LS2.8-BR
  rect 1.07x0.532 smd: 1(1.135,-0.95) 2(1.135,0.95) 3(-1.135,0)
SOT-23-6_L2.9-W1.6-P0.95-LS2.8-BR
  rect 1.1x0.6 smd: 1(1.35,-0.95) 2(1.35,0) 3(1.35,0.95) 4(-1.35,0.95) 5(-1.35,0) 6(-1.35,-0.95)
SW-TH_4P-L6.0-W6.0-P3.90-LS6.5
  round 2 hole 1.2: 1(-3.25,2.25) 2(3.25,2.25) 3(-3.25,-2.25) 4(3.25,-2.25)
SW-TH_G-SWITCH_SS-12F20-G070
  round 1.8 hole 1.2: 1(-3,0) 2(0,0) 3(3,0)
USB-C-SMD_TYPE-C-6PIN-2MD-073
  rect 0.6x1.1 smd: 1(-3.2,2.375) 2(-2.4,2.375) 11(2.4,2.375) 12(3.2,2.375)
  rect 0.3x1.1 smd: 3(-1.75,2.375) 4(-1.25,2.375) 5(-0.75,2.375) 6(-0.25,2.375) 7(0.25,2.375) 8(0.75,2.375) 9(1.25,2.375) 10(1.75,2.375)
  oval 1.2x2 hole 0.6x1.5: 13(-4.325,1.825) 14(4.325,1.825)
  oval 1.2x1.8 hole 0.6x1.2: 13(-4.325,-2.375) 14(4.325,-2.375)

## Nets
As in the schematic, except:
GND: C1.1 C2.2 C3.2 C4.2 C5.2 C7.1 C8.1 C9.1 C10.1 C11.2 C12.1 C13.1 C15.1 C16.1 C17.1 C19.1 C21.1 C22.2 C23.2 C24.1 C25.2 C26.1 C28.2 C29.1 C30.1 C33.2 C34.2 C35.1 FPC1.4 FPC1.10 FPC1.11 FPC1.12 H2.1 H4.2 NOREF#6.1 NOREF#13.1 Q2.3 R6.1 R15.2 R22.1 R41.2 R42.2 R44.2 R45.2 R49.1 R52.2 R55.1 SW1.1 SW1.2 SW2.1 SW2.2 TP1.1 TP2.1 TP3.1 TP4.1 U1.8 U1.23 U1.47 U2.1 U2.3 U3.1 U6.2 U7.4 U8.4 U9.4 USB1.1 USB1.12 USB1.13 USB1.14 X1.2 X1.4
BT+: C26.2 NOREF#14.1 R50.2 SW3.1 U2.5
BT-: C31.1 NOREF#12.2 U4.6 U5.2
PB15_GTIM4_CH1_LA_BA: NOREF#5.1 R47.2 U1.28
$1N278497: R8.1 R11.2
$1N278504: R7.2 R8.2 R10.2 U9.2
$1N281702: NOREF#11.3 R17.1
$1N281704: NOREF.2 R16.1
$1N291358: C14.2 R12.2 U9.7
$1N291374: C11.1 R10.1 R11.1 U9.5
$1N303067: C14.1 C40.1

Pads without a net: NOREF#2 1; NOREF#3 1; NOREF#4 1; NOREF#7 1; NOREF#8 1; NOREF#9 1; NOREF#10 1; NOREF#15 1; NOREF#16 1; NOREF#17 1; NOREF#18 1; TP2#2 1; TP2#3 1; TP2#4 1; TP2#5 1; U1 2 3 4 7 11 12 13 14 15 16 17 18 19 20 21 22 25 26 27 29 31 32 33 35 36 45 46; U4 4; USB1 3 5 6 7 8 9

## Via types
v1: diameter 0.61, hole 0.305, Top Layer to Bottom Layer, 75 vias

## Routing (per net, layer and track width the routed paths; a pad name or vN(x,y) marks a point on that pad's centre or on a via; arc(x,y) is an arc through that point)
+1.65V: length 16.2
  Top Layer w0.5: R52.1 R53.2 64.81,43.61 C35.2 v1(66.55,41.63) ; R23.2 70.22,37.51 ; 70.22,37.51 R20.1 ; 70.22,37.51 v1(66.6,37.77)
  Bottom Layer w0.5: v1(66.6,37.77) v1(66.55,41.63)
+3.3V: length 112.5
  Top Layer w0.254: 30.33,42.28 30.28,43.71 R51.2 R54.2 ; C22.1 U1.24 ; U1.1 40.86,34.12 ; 40.86,34.12 C13.2 ; 40.86,34.12 39.43,34.38 ; FPC1.5 37.66,18.16 C28.1
  Top Layer w0.5: 38.65,15.61 43.68,15.61 47.65,19.58 47.65,29.34 42.98,34.01 40.96,34.01 C13.2 ; 38.65,15.61 37.69,14.66 31.09,14.66 27.33,18.42 27.33,21.67 26.18,22.82 ; 38.65,15.61 C28.1 ; C22.1 30.33,42.28 27.23,41.43 R1.2 24.03,35.64 C1.2 U9.8 27.94,33.55 29.92,33.3 30.02,31.52 28.6,24.87 26.18,22.82 ; 26.18,22.82 25.3,23.7 16.77,23.7 11.7,28.76 U3.2 C30.2
+3.3VA: length 65
  Top Layer w0.254: R54.1 R51.1 41.96,45.49 43.28,43.6 ; C19.2 41.8,42.76 42.72,41.83 42.72,40.24 42.17,39.68 U1.9
  Top Layer w0.5: R53.1 C36.2 63.71,42.6 64.67,42.14 U7.8 C15.2 61.37,40.01 61.37,41.73 61.22,45.24 58.88,46.1 C34.1 ; C21.2 52.17,41.28 C34.1 ; C21.2 R21.2 ; C21.2 U8.8 ; C34.1 47.91,45.29 43.28,43.6 C19.2
GND: length 120.2
  Top Layer w0.254: U1.8 37.43,39.18 NOREF#6.1 ; U1.47 38.93,36.23 NOREF#6.1 ; NOREF#6.1 34.43,40.73 34.43,42.48 ; SW2.1 SW2.2 66.3,28.08 SW1.1 SW1.2 ; FPC1.4 36.66,18.01 37.25,16.84
  Top Layer w0.5: C24.1 12.98,15.19 ; 12.98,15.19 C26.1 ; 12.98,15.19 NOREF#13.1 ; U8.4 v1(57.86,34.93) v1(58.52,34.87) C17.1 ; R15.2 v1(44.55,30.66) ; Q2.3 v1(48.78,9.9) v1(48.77,9.32) ; C25.2 v1(56.76,8.77) v1(56.76,8.03) H4.2 ; v1(10.72,33.96) 10.67,33.91 v1(10.67,33.17) C30.1 ; C11.2 v1(20.43,28.64) v1(20.43,29.47) U9.4 ; C7.1 v1(15.7,37.26) ; U2.3 NOREF#13.1 ; NOREF#13.1 18.38,15.76 18.43,15.88 ; NOREF#13.1 18.43,15.88 ; v1(62.33,41.38) 62.34,41.37 63.35,41.37 ; C5.2 26.06,45.64 v1(26.11,45.7) ; 18.43,15.88 18.85,16.89 U2.1 ; 18.43,15.88 R45.2 R42.2 ; C1.1 v1(25.71,37.82) ; 48.74,40.2 v1(49.25,40.22) 50.81,40.26 ; 48.74,40.2 v1(47.58,41.51) 47.25,41.89 46.59,42.44 v1(44.5,41.83) 44.5,41.53 v1(43.33,40.36) ; 48.74,40.2 C16.1 X1.4 C12.1 ; R22.1 v1(51.56,33.3) ; v1(68.99,45.39) R52.2 C35.1 v1(68.84,43.66) ; U7.4 v1(68.53,35.84) ; C9.1 v1(20.42,40.72) ; C23.2 v1(59.13,41.02) ; v1(26.42,42.04) 26.32,41.94 C10.1 ; C22.2 v1(31.75,44.83) ; R41.2 v1(31.14,11.61) R44.2 ; USB1.12 35.47,6.83 ; C33.2 v1(29.92,18.16) ; C8.1 v1(17.08,40.77) ; R55.1 v1(10.9,10.15) v1(11.8,10.41) v1(12.74,10.69) v1(13.78,11) v1(14.63,11) 15.06,10.57 v1(15.06,9.82) v1(15.06,8.26) 15.06,7.42 U6.2 ; C2.2 v1(14.94,47.93) ; R49.1 v1(44.43,10.24) ; C13.1 v1(41.76,32.6) ; R6.1 v1(18.14,37.41) ; C4.2 20.54,46.55 v1(20.47,46.61) ; v1(16.82,46.71) 16.93,46.6 C3.2 ; USB1.1 USB1.13 ; C19.1 v1(40.29,44.83) ; C29.1 U3.1 ; 37.25,16.84 v1(37.09,15.67)
  vias: v1(10.77,25.78) v1(10.77,24) v1(10.77,22.43)
VCC: length 96.7
  Top Layer w0.5: Q1.3 C25.1 R40.2 55.65,11.76 58.73,11.76 58.73,1.55 58.17,0.99 47.65,0.99 34.95,13.69 27.84,13.69 24.54,16.99 24.54,22.33 14.58,22.33 13.11,20.85 6,20.85 6,28.78 ; SW3.2 5.59,27.66 ; C29.2 U3.3
(no net): length 1595.3
  Top Layer w0.254: 36.53,51.21 36.53,50.9 35.82,50 ; 48.82,66.1 48.82,72.17 arc(49.12,73.7) NOREF#10.1 ; 27.12,83.88 27.12,77.81 arc(26.81,76.29) NOREF#7.1 ; 43.03,56.05 43.03,93.43 ; 39.52,98.76 38.94,98.81 37.95,98.81 37.95,51.41 38.46,50.9 38.81,50.65 40.13,50 ; 44.04,57.42 44.04,92.01 ; 30.88,91.1 30.88,59.45 ; 28.34,86.58 28.34,64.16 ; 28.84,87.59 28.84,63 ; 33.42,56.15 33.42,94.6 ; 47.6,63.41 47.6,85.83 ; 42.52,93.84 42.52,55.38 ; 48.11,64.58 48.11,84.7 ; 45.06,58.89 45.06,90.54 ; 27.83,85.41 27.83,65.29 ; 29.35,88.56 29.35,62.04 ; 31.89,92.57 31.89,57.98 ; 31.38,91.81 31.38,58.69 ; 46.59,61.43 46.59,87.95 ; 45.57,59.7 45.57,89.73 ; 32.91,93.94 32.91,56.55 ; 44.55,58.18 44.55,91.3 ; 46.08,60.53 46.08,88.86 ; 29.86,89.46 29.86,61.12 ; 32.4,93.28 32.4,57.26 ; 30.37,90.28 30.37,60.26 ; 47.09,62.4 47.09,86.98 ; 43.54,56.71 43.54,92.72
  Bottom Layer w0.254: 48.82,83.88 48.82,77.81 arc(49.12,76.29) NOREF#10.1 ; 30.88,58.89 30.88,90.54 ; 45.06,91.1 45.06,59.45 ; 27.83,64.58 27.83,84.7 ; 39.47,51.21 38.51,51.05 38,50.8 38,50 37.95,50 37.95,98.71 36.98,98.81 36.48,98.76 ; 48.11,85.41 48.11,65.29 ; 46.08,89.46 46.08,61.12 ; 44.55,91.81 44.55,58.69 ; 46.59,88.56 46.59,62.04 ; 29.35,61.43 29.35,87.95 ; 45.57,90.28 45.57,60.26 ; 43.54,93.28 43.54,57.26 ; 33.42,93.84 33.42,55.38 ; 29.86,60.53 29.86,88.86 ; 28.34,63.41 28.34,85.83 ; 44.04,92.57 44.04,57.98 ; 47.09,87.59 47.09,63 ; 28.84,62.4 28.84,86.98 ; 32.4,56.71 32.4,92.72 ; 27.12,66.1 27.12,72.17 arc(26.81,73.7) NOREF#7.1 ; 47.6,86.58 47.6,64.16 ; 43.03,93.94 43.03,56.55 ; 30.37,59.7 30.37,89.73 ; 31.38,58.18 31.38,91.3 ; 42.52,56.15 42.52,94.6 ; 32.91,56.05 32.91,93.43 ; 31.89,57.42 31.89,92.01
BT+: length 16.4
  Top Layer w0.5: 15.09,12.44 C26.2 11.69,12.68 NOREF#14.1 R50.2
BT-: length 78.1
  Top Layer w0.5: U4.6 8.59,3.58 C31.1 v1(14.94,0.94) v1(14.94,1.6) v1(14.94,2.23) 14.94,3.33 U5.2
  Bottom Layer w0.5: v1(14.94,2.23) v1(14.94,1.6) v1(14.94,0.94)
  Bottom Layer w1: v1(14.94,0.94) 18.9,0.84 69.29,0.84 69.35,7.62 NOREF#12.2
PA0_ADC: length 19
  Top Layer w0.254: U1.10 41.81,40.18 42.06,40.44 v1(42.06,41.53)
  Top Layer w0.5: U8.7 R25.2 54.52,43.92 v1(52.02,43.92) ; v1(43.28,42.14) 43.74,42.55 45.67,43.31 v1(49.63,43.61)
  Bottom Layer w0.254: v1(42.06,41.53) v1(43.28,42.14)
  Bottom Layer w0.5: v1(52.02,43.92) v1(49.63,43.61)
PA9_GTIM3_CH1: length 9.8
  Top Layer w0.254: U1.30 30.13,38.68 29.77,41.09 v1(30.02,41.43)
  Top Layer w0.5: R5.2 v1(29.47,42.85)
  Bottom Layer w0.254: v1(30.02,41.43) v1(29.47,42.85)
PA13_SWDIO: length 4.3
  Top Layer w0.254: U1.34 30.99,36.68 H3.1
PA14_SWCLK: length 5.6
  Top Layer w0.254: U1.37 H1.1
PA15_SPI1_CS_LCD_A0: length 18.6
  Top Layer w0.254: 34.43,34.38 34.43,28.47 37.14,25.77 v1(37.14,22.68)
  Bottom Layer w0.254: FPC1.8 40.66,20.33 v1(39.37,21.62) v1(37.14,22.68)
PB3_SPI1_SCK: length 17.6
  Top Layer w0.254: U1.39 34.93,29.11 37.85,26.19 v1(37.85,21.01)
  Bottom Layer w0.254: v1(37.85,21.01) 39.63,19.69 FPC1.7
PB4_LCD_RST: length 18.4
  Top Layer w0.254: v1(39.37,26.59) 39.37,23.04 41.66,20.75 FPC1.9 ; v1(37.95,27.36) 35.43,29.88 35.43,34.38
  Bottom Layer w0.254: v1(39.37,26.59) v1(37.95,27.36)
PB5_SPI1_MOSI: length 16.7
  Top Layer w0.254: FPC1.6 38.66,28.68 35.92,31.42 35.92,34.37 U1.41
PB15_GTIM4_CH1_LA_BA: length 37.8
  Top Layer w0.254: R47.2 49.84,18.92 NOREF#5.1 ; v1(40.03,23.6) v1(46.74,23.24) ; U1.28 v1(30.84,39.68) ; v1(30.84,34.06) 35.36,23.7 v1(36.22,23.7)
  Bottom Layer w0.254: v1(46.74,23.24) NOREF#5.1 ; v1(36.22,23.7) v1(40.03,23.6) ; v1(30.84,39.68) v1(30.84,34.06)
$1N13991: length 3.9
  Top Layer w0.5: U5.3 U6.3
$1N14154: length 2.5
  Top Layer w0.5: U4.1 U5.1
$1N14198: length 2.4
  Top Layer w0.5: U4.3 U6.1
$1N14351: length 4.1
  Top Layer w0.254: R55.2 9.5,5.31 U4.2
$1N15015: length 2.2
  Top Layer w0.5: R43.1 U2.2
$1N15845: length 7.2
  Top Layer w0.5: 17.63,12.44 17.68,11.2 R38.1
$1N15894: length 4.5
  Top Layer w0.5: R39.1 16.31,11.15 16.36,12.44
$1N16826: length 2.7
  Top Layer w0.254: USB1.4 29.89,8.81 R44.1
$1N16875: length 2.8
  Top Layer w0.254: USB1.10 32.89,8.36 R41.1
$1N19532: length 7.1
  Top Layer w0.5: 6.81,5.31 U4.5 ; 6.81,5.31 6.81,2.31 C31.2 ; 6.81,5.31 R50.1
$1N165486: length 3.7
  Top Layer w0.5: R43.2 R45.1 R42.1
$1N167672: length 69.9
  Top Layer w0.254: LED11.1 21.51,1.04 ; 21.51,1.04 18.65,1.04 LED12.1 ; 21.51,1.04 25,1.04 25.55,1.65 25.55,8.05 26.37,8.71 27.69,9.37 28.74,9.36
  Top Layer w0.5: 28.74,12.4 USB1.2 ; 28.74,12.4 28.74,12.78 33.53,12.78 USB1.11 ; 28.74,12.4 23.57,12.47 ; 23.57,12.47 23.57,21.41 15.09,21.41 U2.4 C24.2 ; 23.57,12.47 18.9,12.44
$1N179497: length 4.3
  Top Layer w0.254: R38.2 24.08,2.87
$1N179538: length 4.3
  Top Layer w0.254: R39.2 LED12.2
$1N206778: length 7.1
  Top Layer w0.254: R15.1 39.78,30.66 37.43,33.01 37.43,34.38
$1N234129: length 21.6
  Top Layer w0.254: R13.1 52.47,26.34 53.65,26.34 54.31,25.68 64.3,25.68 SW1.3 SW1.4
$1N234138: length 10.4
  Top Layer w0.254: 62.59,23.58 56.09,23.58 55.31,24.36 R14.1
$1N234147: length 18.3
  Top Layer w0.254: R13.2 v1(48.62,26.44) ; U1.43 36.93,32.64 43.18,26.39 46.59,26.39 v1(46.64,26.44)
  Bottom Layer w0.254: v1(48.62,26.44) v1(46.64,26.44)
$1N234151: length 20.1
  Top Layer w0.254: R14.2 49.74,25.58 v1(48.57,25.58) ; 36.43,34.38 36.43,32.03 42.88,25.58 v1(46.66,25.58)
  Bottom Layer w0.254: v1(48.57,25.58) v1(46.66,25.58)
$1N252869: length 1.8
  Top Layer w0.254: C33.1 33.66,18.21 FPC1.1
$1N252872: length 2.2
  Top Layer w0.254: C32.2 34.65,18.11 FPC1.2
$1N252875: length 2
  Top Layer w0.254: FPC1.3 35.66,17.91 C32.1
$1N256375: length 6
  Top Layer w0.5: 18.99,43.76 18.33,45.85 ; 18.99,43.76 R2.2 ; 18.99,43.76 C8.2
$1N256389: length 5.7
  Top Layer w0.5: R3.2 R4.1 ; R4.1 C4.1 ; R4.1 C9.2
$1N256398: length 5.3
  Top Layer w0.5: C10.2 R4.2 ; R4.2 R5.1 ; R4.2 C5.1
$1N256743: length 10.5
  Top Layer w0.5: C6.2 15.5,40.01 15.08,41.63 R2.1 C2.1
$1N259805: length 9.8
  Top Layer w0.5: R24.1 65.48,38.08 U7.7 66.09,40.77 67.24,40.77 U7.6
$1N259808: length 8.5
  Top Layer w0.5: R18.1 61.52,36.65 U7.1 64.72,33.05 65.97,33.05 U7.2
$1N260186: length 11.5
  Top Layer w0.5: U8.5 56.85,38.89 55.22,38.63 R21.1 R22.2 50.34,35.64 C20.1
$1N260302: length 1.8
  Top Layer w0.5: C23.1 R27.1
$1N263980: length 11.1
  Top Layer w0.5: U9.3 v1(19.15,31.45) ; 21.48,37.41 v1(21.44,36.3) ; 21.48,37.41 R6.2 ; 21.48,37.41 C6.1 ; 21.48,37.41 R1.1
  Bottom Layer w0.5: v1(19.15,31.45) v1(21.44,36.3)
$1N267629: length 2
  Top Layer w0.5: D1.1 R40.1
$1N267665: length 2.1
  Top Layer w0.5: 44.43,12.57 D2.2
$1N267709: length 8.1
  Top Layer w0.5: H4.1 C27.2
$1N274948: length 6.7
  Top Layer w0.254: X1.1 43.49,39.55 43.03,39.29 42.27,38.53 41.66,38.18 U1.6
  Top Layer w0.5: C16.2 X1.1
$1N275074: length 6.2
  Top Layer w0.254: X1.3 43.08,36.55 41.76,37.67 U1.5
  Top Layer w0.5: C12.2 X1.3
$1N278497: length 1.9
  Top Layer w0.5: R11.2 R8.1
$1N278504: length 6.3
  Top Layer w0.5: U9.2 R7.2 R10.2 R8.2
$1N281702: length 39
  Top Layer w0.254: 36,49.69 36.83,48.29 38.05,47.88 41.5,48.49 49.33,48.74 61.16,48.9 66.5,48.39 68.73,47.12 69.5,46.05 69.8,45.49 69.95,44.83 R17.1
$1N281704: length 36.5
  Top Layer w0.254: R16.1 70.92,44.88 69.24,47.57 67.36,49.1 61.98,49.56 41.86,49.45 40.47,49.91
$1N281778: length 6.8
  Top Layer w0.5: U7.5 R23.1 ; R23.1 71.27,39.29 C18.1 ; R23.1 R17.2
$1N281786: length 15.6
  Top Layer w0.5: R16.2 74.63,38.74 74.63,36.45 C18.2 R20.2 70.26,32.91 68.75,32.61 67.14,32.76 U7.3
$1N284976: length 1.8
  Top Layer w0.5: Q1.2 R46.2
$1N284978: length 1.8
  Top Layer w0.5: R48.1 Q2.2
$1N291348: length 6.7
  Top Layer w0.5: R9.2 23.98,30.91 24.64,31.42 U9.6 R12.1
$1N291358: length 28.3
  Top Layer w0.5: C14.2 12.45,37.62 14.02,35.79 16.36,35.69 18.39,35.79 20.22,35.54 22.51,35.03 23.27,34.21 24.49,32.74 U9.7 R12.2
$1N291374: length 13.2
  Top Layer w0.5: U9.5 25,26.85 21.59,25.98 C11.1 R11.1 R10.1
$1N299296: length 5.6
  Top Layer w0.5: R27.2 C37.2 R25.1 U8.6
$1N299403: length 8.3
  Top Layer w0.5: C39.1 R19.1 56.09,33.55 U8.3 56.14,36.25 56.64,36.65 R18.2
$1N299407: length 6
  Top Layer w0.5: C39.2 R19.2 60.61,33.2 61.06,34.01 C17.2
$1N299413: length 10.5
  Top Layer w0.5: C38.1 R26.1 U8.2 54.66,36.75 56.09,37.82 R24.2
$1N299416: length 8.8
  Top Layer w0.5: C20.2 49.94,31.27 C38.2 R26.2 U8.1
$1N299581: length 4.3
  Top Layer w0.5: 46.87,6.29 C27.1 R46.1
$1N299584: length 10.2
  Top Layer w0.5: 49.81,11.53 Q1.1 ; 49.81,11.53 49.78,14.05 ; 49.81,11.53 Q2.1 ; 49.78,14.05 D2.1 ; 49.78,14.05 R47.1 ; 49.78,14.05 D1.2
$1N303067: length 2.7
  Top Layer w0.5: C40.1 C14.1
$1N303075: length 18.7
  Top Layer w0.5: C40.2 10.92,35.69 13.46,34.47 15.29,34.27 R7.1 U9.1 21.85,33.86 22.15,33.1 R9.1

## Copper pours and planes (outline as drawn; the poured copper is in the pictures)
GND on Top Layer: 9.81,27.31 11.58,27.31 11.58,21.82 9.81,21.82
GND on Bottom Layer: 0,50 76,50 76,0 0,0
VCC on Top Layer: 1.07,32.34 9.09,32.34 9.09,26.19 1.07,26.19
(no net) on Top Layer: 0.41,99.7 12.55,99.7 12.55,50.11 0.41,50.11
(no net) on Top Layer: 63.37,99.7 75.52,99.7 75.52,50.11 63.37,50.11
BT+ on Top Layer: 2.08,25.63 4.32,25.63 4.32,10.39 2.08,10.39

## Text on the board
Bottom Silkscreen Layer: SWDIO | SWCLK | GND | 清零
Top Silkscreen Layer: SWDIO | SWCLK | 激励输出 | 喇叭 | 电池正 | 电池负
